# Altium project RcMPPT-SCC.PrjPcb
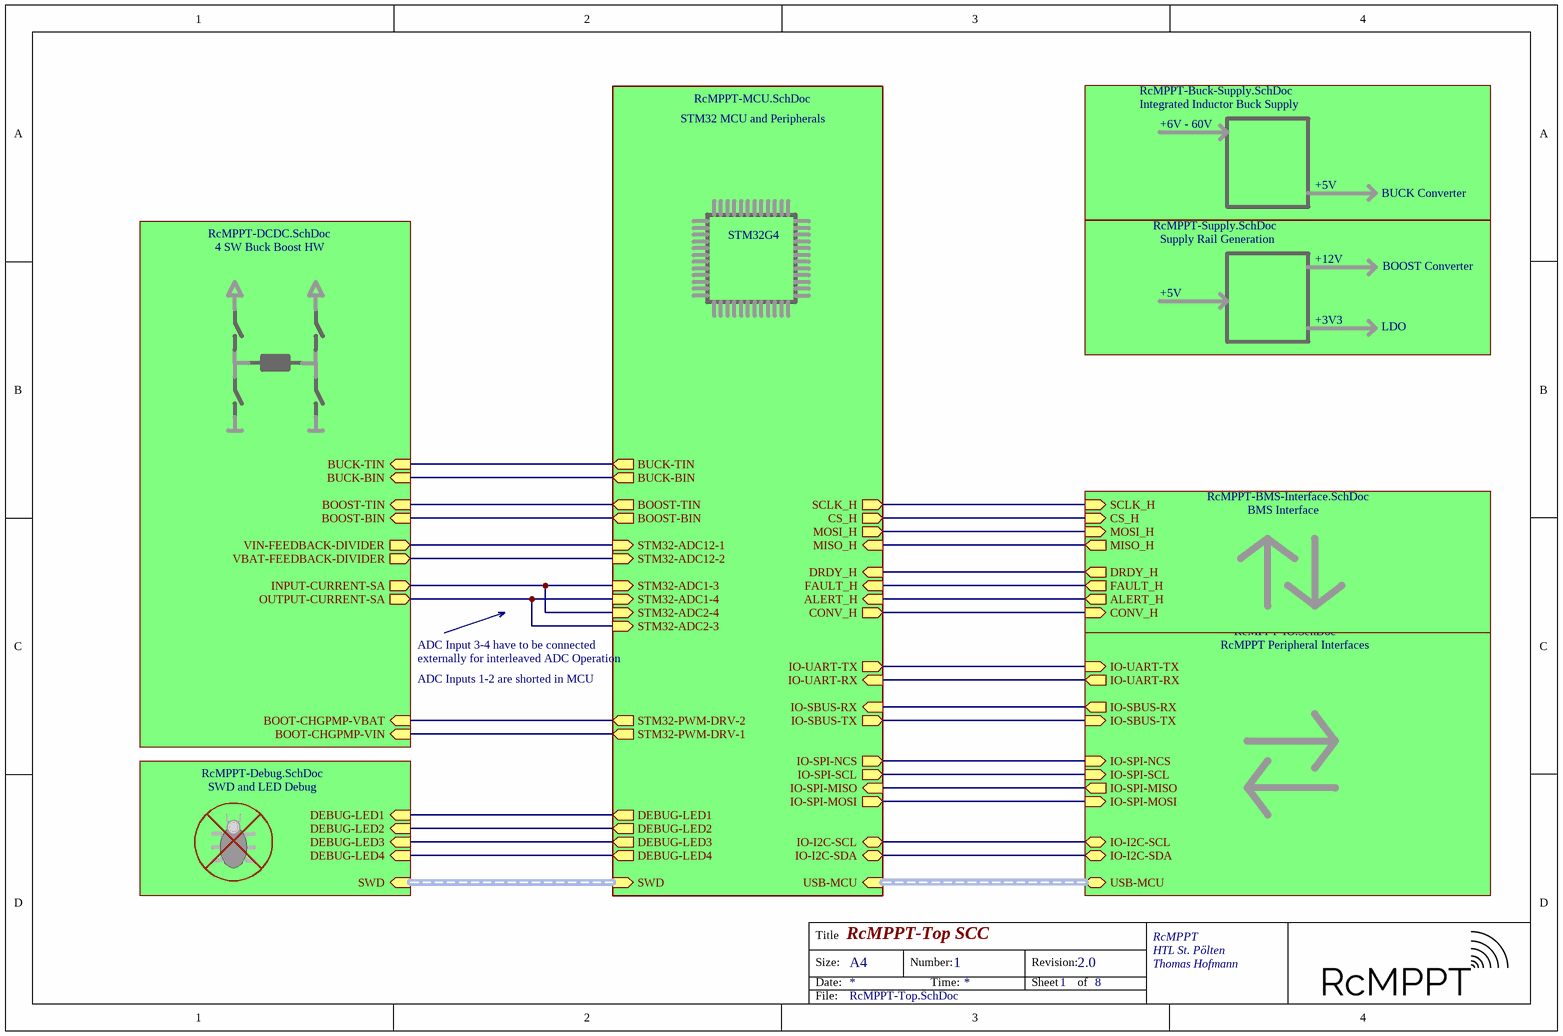
[diagram p0: RcMPPT-Top.SchDoc]
8 sheets, 168 parts. Net scope: hierarchical (ports join the sheet entries above them; power ports are global).
Board file: RcMPPT-SCC.PcbDoc
Sheets:
  RcMPPT-Top.SchDoc
    4 SW Buck Boost HW = RcMPPT-DCDC.SchDoc
    RcMPPT Peripheral Interfaces = RcMPPT-IO.SchDoc
    STM32 MCU and Peripherals = RcMPPT-MCU.SchDoc
    Integrated Inductor Buck Supply = RcMPPT-Buck-Supply.SchDoc
    SWD and LED Debug = RcMPPT-Debug.SchDoc
    Supply Rail Generation = RcMPPT-Supply.SchDoc
    BMS Interface = RcMPPT-BMS-Interface.SchDoc

## Sheet RcMPPT-Top.SchDoc: RcMPPT-Top SCC
size A4; Author: Thomas Hofmann; CompanyName: HTL St. Pölten; Organization: Altium Limited; Address1: RcMPPT; Address2: Frenchs Forest; Address3: NSW; Address4: Australia 2086; DocumentNumber: 1; Revision: 2.0; SheetNumber: 1; SheetTotal: 8

### Sub-sheets
4 SW Buck Boost HW = RcMPPT-DCDC.SchDoc: VBAT-FEEDBACK-DIVIDER (out), VIN-FEEDBACK-DIVIDER (out), BOOST-BIN (in), BOOST-TIN (in), BUCK-TIN (in), BUCK-BIN (in), OUTPUT-CURRENT-SA (out), INPUT-CURRENT-SA (out), BOOT-CHGPMP-VBAT (in), BOOT-CHGPMP-VIN (in)
BMS Interface = RcMPPT-BMS-Interface.SchDoc: DRDY_H (out), FAULT_H (out), SCLK_H (in), CS_H (in), MOSI_H (in), CONV_H (in), MISO_H (out), ALERT_H (out)
Integrated Inductor Buck Supply = RcMPPT-Buck-Supply.SchDoc: no entries
RcMPPT Peripheral Interfaces = RcMPPT-IO.SchDoc: USB-MCU (bidir, harness USB-HARNESS), IO-I2C-SDA (bidir), IO-I2C-SCL (bidir), IO-SPI-MOSI (in), IO-SPI-MISO (out), IO-SPI-SCL (in), IO-SPI-NCS (in), IO-SBUS-TX (in), IO-SBUS-RX (out), IO-UART-RX (out), IO-UART-TX (in)
STM32 MCU and Peripherals = RcMPPT-MCU.SchDoc: STM32-ADC12-2 (in), STM32-ADC12-1 (in), BOOST-BIN (out), BOOST-TIN (out), BUCK-BIN (out), BUCK-TIN (out), USB-MCU (in, harness USB-HARNESS), SWD (in, harness SWD-HARNESS), DEBUG-LED4 (out), DEBUG-LED3 (out), DEBUG-LED2 (out), DEBUG-LED1 (out), STM32-ADC2-4 (in), STM32-ADC2-3 (in), STM32-ADC1-4 (in), STM32-ADC1-3 (in), STM32-PWM-DRV-1 (out), STM32-PWM-DRV-2 (out), IO-I2C-SDA (bidir), IO-I2C-SCL (bidir), IO-SPI-MOSI (out), IO-SPI-MISO (in), IO-SPI-SCL (out), IO-SPI-NCS (out), IO-SBUS-TX (out), IO-SBUS-RX (in), IO-UART-RX (in), IO-UART-TX (out), DRDY_H (in), FAULT_H (in), SCLK_H (out), CS_H (out), MOSI_H (out), CONV_H (out), MISO_H (in), ALERT_H (in)
Supply Rail Generation = RcMPPT-Supply.SchDoc: no entries
SWD and LED Debug = RcMPPT-Debug.SchDoc: SWD (in, harness SWD-HARNESS), DEBUG-LED4 (in), DEBUG-LED3 (in), DEBUG-LED2 (in), DEBUG-LED1 (in)

### Nets
ALERT_H: sheet STM32 MCU and Peripherals/ALERT_H, sheet BMS Interface/ALERT_H
BOOST-BIN: sheet 4 SW Buck Boost HW/BOOST-BIN, sheet STM32 MCU and Peripherals/BOOST-BIN
BOOST-TIN: sheet 4 SW Buck Boost HW/BOOST-TIN, sheet STM32 MCU and Peripherals/BOOST-TIN
BOOT-CHGPMP-VBAT: sheet 4 SW Buck Boost HW/BOOT-CHGPMP-VBAT, sheet STM32 MCU and Peripherals/STM32-PWM-DRV-2
BOOT-CHGPMP-VIN: sheet 4 SW Buck Boost HW/BOOT-CHGPMP-VIN, sheet STM32 MCU and Peripherals/STM32-PWM-DRV-1
BUCK-BIN: sheet 4 SW Buck Boost HW/BUCK-BIN, sheet STM32 MCU and Peripherals/BUCK-BIN
BUCK-TIN: sheet 4 SW Buck Boost HW/BUCK-TIN, sheet STM32 MCU and Peripherals/BUCK-TIN
CONV_H: sheet STM32 MCU and Peripherals/CONV_H, sheet BMS Interface/CONV_H
CS_H: sheet STM32 MCU and Peripherals/CS_H, sheet BMS Interface/CS_H
DEBUG-LED1: sheet STM32 MCU and Peripherals/DEBUG-LED1, sheet SWD and LED Debug/DEBUG-LED1
DEBUG-LED2: sheet STM32 MCU and Peripherals/DEBUG-LED2, sheet SWD and LED Debug/DEBUG-LED2
DEBUG-LED3: sheet STM32 MCU and Peripherals/DEBUG-LED3, sheet SWD and LED Debug/DEBUG-LED3
DEBUG-LED4: sheet STM32 MCU and Peripherals/DEBUG-LED4, sheet SWD and LED Debug/DEBUG-LED4
DRDY_H: sheet STM32 MCU and Peripherals/DRDY_H, sheet BMS Interface/DRDY_H
FAULT_H: sheet STM32 MCU and Peripherals/FAULT_H, sheet BMS Interface/FAULT_H
INPUT-CURRENT-SA: sheet 4 SW Buck Boost HW/INPUT-CURRENT-SA, sheet STM32 MCU and Peripherals/STM32-ADC2-4, sheet STM32 MCU and Peripherals/STM32-ADC1-3
IO-I2C-SCL: sheet RcMPPT Peripheral Interfaces/IO-I2C-SCL, sheet STM32 MCU and Peripherals/IO-I2C-SCL
IO-I2C-SDA: sheet RcMPPT Peripheral Interfaces/IO-I2C-SDA, sheet STM32 MCU and Peripherals/IO-I2C-SDA
IO-SBUS-RX: sheet RcMPPT Peripheral Interfaces/IO-SBUS-RX, sheet STM32 MCU and Peripherals/IO-SBUS-RX
IO-SBUS-TX: sheet RcMPPT Peripheral Interfaces/IO-SBUS-TX, sheet STM32 MCU and Peripherals/IO-SBUS-TX
IO-SPI-MISO: sheet RcMPPT Peripheral Interfaces/IO-SPI-MISO, sheet STM32 MCU and Peripherals/IO-SPI-MISO
IO-SPI-MOSI: sheet RcMPPT Peripheral Interfaces/IO-SPI-MOSI, sheet STM32 MCU and Peripherals/IO-SPI-MOSI
IO-SPI-NCS: sheet RcMPPT Peripheral Interfaces/IO-SPI-NCS, sheet STM32 MCU and Peripherals/IO-SPI-NCS
IO-SPI-SCL: sheet RcMPPT Peripheral Interfaces/IO-SPI-SCL, sheet STM32 MCU and Peripherals/IO-SPI-SCL
IO-UART-RX: sheet RcMPPT Peripheral Interfaces/IO-UART-RX, sheet STM32 MCU and Peripherals/IO-UART-RX
IO-UART-TX: sheet RcMPPT Peripheral Interfaces/IO-UART-TX, sheet STM32 MCU and Peripherals/IO-UART-TX
MISO_H: sheet STM32 MCU and Peripherals/MISO_H, sheet BMS Interface/MISO_H
MOSI_H: sheet STM32 MCU and Peripherals/MOSI_H, sheet BMS Interface/MOSI_H
OUTPUT-CURRENT-SA: sheet 4 SW Buck Boost HW/OUTPUT-CURRENT-SA, sheet STM32 MCU and Peripherals/STM32-ADC2-3, sheet STM32 MCU and Peripherals/STM32-ADC1-4
SCLK_H: sheet STM32 MCU and Peripherals/SCLK_H, sheet BMS Interface/SCLK_H
STM32-ADC12-1: sheet 4 SW Buck Boost HW/VIN-FEEDBACK-DIVIDER, sheet STM32 MCU and Peripherals/STM32-ADC12-1
STM32-ADC12-2: sheet 4 SW Buck Boost HW/VBAT-FEEDBACK-DIVIDER, sheet STM32 MCU and Peripherals/STM32-ADC12-2

### Buses and harness runs
harness sheet RcMPPT Peripheral Interfaces/USB-MCU = sheet STM32 MCU and Peripherals/USB-MCU
harness sheet STM32 MCU and Peripherals/SWD = sheet SWD and LED Debug/SWD

### Notes on the sheet
- +6V - 60V
- STM32G4
- +5V
- BUCK Converter
- +12V
- BOOST Converter
- +3V3
- LDO
- ADC Input 3-4 have to be connected
- ADC Inputs 1-2 are shorted in MCU
- externally for interleaved ADC Operation
- Title
- Size:
- Date:
- A4
- Number:
- Time:
- Revision:
- Sheet
- of
- RcMPPT
- File:

## Sheet RcMPPT-DCDC.SchDoc: RcMPPT-DCDC
size A4; Author: Thomas Hofmann; CompanyName: HTL St. Pölten; Organization: Altium Limited; Address1: RcMPPT; Address2: Frenchs Forest; Address3: NSW; Address4: Australia 2086; DocumentNumber: 4; Revision: 2.0; SheetNumber: 4; SheetTotal: 8
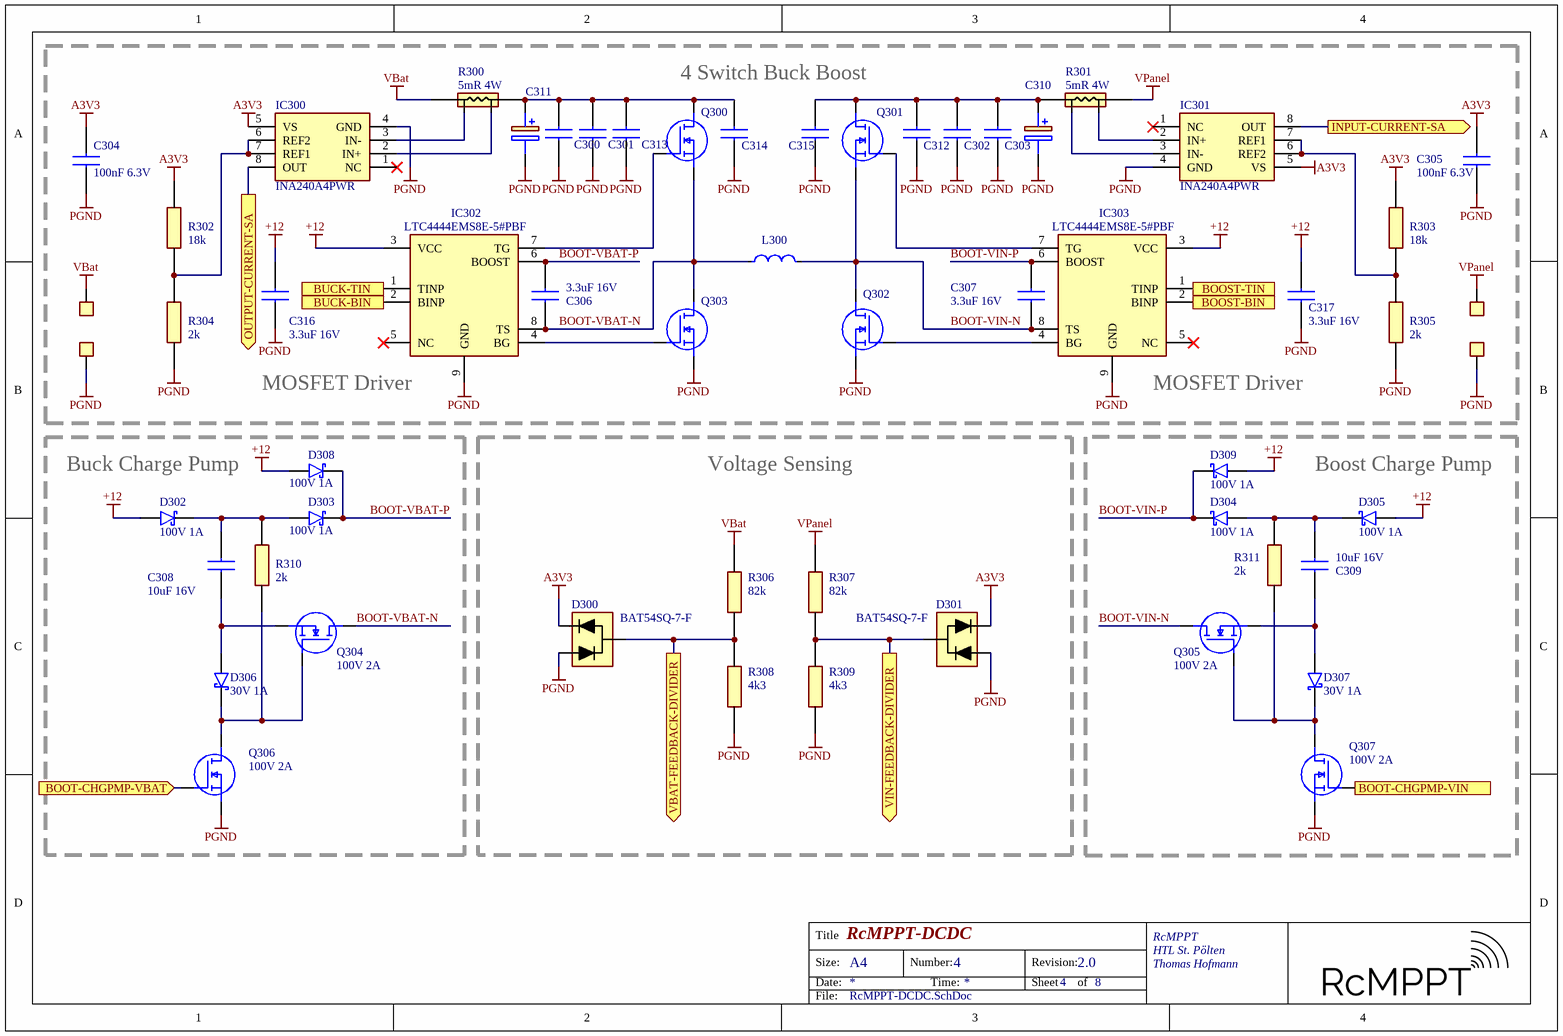
[diagram p1: RcMPPT-DCDC.SchDoc]

### Parts
C300  10uF 100V  [CAPC3225X270N]  (value not drawn)
C301  10uF 100V  [CAPC3225X270N]  (value not drawn)
C302  10uF 100V  [CAPC3225X270N]  (value not drawn)
C303  10uF 100V  [CAPC3225X270N]  (value not drawn)
C304  100nF 6.3V  [CAPC1608X97N]
C305  100nF 6.3V  [CAPC1608X97N]
C306  3.3uF 16V  [CAPC1608X97N]
C307  3.3uF 16V  [CAPC1608X97N]
C308  10uF 16V  [CAPC2012X88N]
C309  10uF 16V  [CAPC2012X88N]
C310  47uF 100VDC 10mm  [CAPAE1030X1050N]  (value not drawn)
C311  47uF 100VDC 10mm  [CAPAE1030X1050N]  (value not drawn)
C312  10uF 100V  [CAPC3225X270N]  (value not drawn)
C313  10uF 100V  [CAPC3225X270N]  (value not drawn)
C314  10uF 100V  [CAPC3225X270N]  (value not drawn)
C315  10uF 100V  [CAPC3225X270N]  (value not drawn)
C316  3.3uF 16V  [CAPC1608X97N]
C317  3.3uF 16V  [CAPC1608X97N]
D300  BAT54SQ-7-F  [SOT96P240X110-3N]
D301  BAT54SQ-7-F  [SOT96P240X110-3N]
D302  100V 1A  [SOD-323]
D303  100V 1A  [SOD-323]
D304  100V 1A  [SOD-323]
D305  100V 1A  [SOD-323]
D306  30V 1A  [SOD-323]
D307  30V 1A  [SOD-323]
D308  100V 1A  [SOD-323]
D309  100V 1A  [SOD-323]
IC300  INA240A4PWR  [SOP65P640X120-8N]
IC301  INA240A4PWR  [SOP65P640X120-8N]
IC302  LTC4444EMS8E-5#PBF  [SOP65P490X110-9N]
IC303  LTC4444EMS8E-5#PBF  [SOP65P490X110-9N]
L300  IHLP6767GZER2R2M01  [FP-IHLP-6767GZ-FP_3_825x1-MFG]  (value not drawn)
P300  PowerPad  [POWER_PAD]  (value not drawn)
P301  PowerPad  [POWER_PAD]  (value not drawn)
P302  PowerPad  [POWER_PAD]  (value not drawn)
P303  PowerPad  [POWER_PAD]  (value not drawn)
Q300  SIR680ADP-T1-RE3  [SI7141DPT1GE3]  (value not drawn)
Q301  SIR680ADP-T1-RE3  [SI7141DPT1GE3]  (value not drawn)
Q302  SIR680ADP-T1-RE3  [SI7141DPT1GE3]  (value not drawn)
Q303  SIR680ADP-T1-RE3  [SI7141DPT1GE3]  (value not drawn)
Q304  100V 2A  [SI2305TP]
Q305  100V 2A  [SI2305TP]
Q306  100V 2A  [SI2305TP]
Q307  100V 2A  [SI2305TP]
R300  5mR 4W  [FC4L90R005FER]
R301  5mR 4W  [FC4L90R005FER]
R302  18k  [RESC1005X40N]
R303  18k  [RESC1005X40N]
R304  2k  [RESC1005X40N]
R305  2k  [RESC1005X40N]
R306  82k  [RESC1608X50N]
R307  82k  [RESC1608X50N]
R308  4k3  [RESC1608X50N]
R309  4k3  [RESC1608X50N]
R310  2k  [RESC1608X50N]
R311  2k  [RESC1608X50N]

### Blocks framed on the sheet
Buck Charge Pump: C308 D302 D303 D306 D308 Q304 Q306 R310
Voltage Sensing: D300 D301 R306-R309
Boost Charge Pump: C309 D304 D305 D307 D309 Q305 Q307 R311

### Ports
BOOST-BIN (in), BOOST-TIN (in), BOOT-CHGPMP-VBAT (in), BOOT-CHGPMP-VIN (in), BUCK-BIN (in), BUCK-TIN (in), INPUT-CURRENT-SA (out), OUTPUT-CURRENT-SA (out), VBAT-FEEDBACK-DIVIDER (out), VIN-FEEDBACK-DIVIDER (out)

### Nets
+12: C316.1 C317.1 D302.2(A) D305.2(A) D308.2(A) D309.2(A) IC302.3(VCC) IC303.3(VCC)
A3V3: C304.2 C305.2 D300.2(K) D301.2(K) IC300.5(VS) IC301.5(VS) R302.2 R303.2
PGND: C300.2 C301.2 C302.2 C303.2 C304.1 C305.1 C310.2(-) C311.2(-) C312.2 C313.2 C314.2 C315.2 C316.2 C317.2 D300.1(A) D301.1(A) IC300.4(GND) IC301.4(GND) IC302.9(GND) IC303.9(GND) P302.1 P303.1 Q302.1,_2,_3(S) Q303.1,_2,_3(S) Q306.2(S) Q307.2(S) R304.1 R305.1 R308.1 R309.1
VBat: P300.1 R300.3 R306.2
VPanel: P301.1 R301.2 R307.2
BOOST-BIN: IC303.2(BINP) ; port BOOST-BIN
BOOST-TIN: IC303.1(TINP) ; port BOOST-TIN
BOOT-CHGPMP-VBAT: Q306.1(G) ; port BOOT-CHGPMP-VBAT
BOOT-CHGPMP-VIN: Q307.1(G) ; port BOOT-CHGPMP-VIN
BOOT-VBAT-N: C306.2 IC302.8(TS) L300.1 Q300.1,_2,_3(S) Q303.5,6,7,8,9,10,11(D) Q304.3(D)  [project net BOOT-VBAT-N_4]
BOOT-VBAT-P: C306.1 D303.1(K) D308.1(K) IC302.6(BOOST)  [project net BOOT-VBAT-P_4]
BOOT-VIN-N: C307.2 IC303.8(TS) L300.2 Q301.1,_2,_3(S) Q302.5,6,7,8,9,10,11(D) Q305.3(D)  [project net BOOT-VIN-N_4]
BOOT-VIN-P: C307.1 D304.1(K) D309.1(K) IC303.6(BOOST)  [project net BOOT-VIN-P_4]
BUCK-BIN: IC302.2(BINP) ; port BUCK-BIN
BUCK-TIN: IC302.1(TINP) ; port BUCK-TIN
INPUT-CURRENT-SA: IC301.8(OUT) ; port INPUT-CURRENT-SA
OUTPUT-CURRENT-SA: IC300.8(OUT) ; port OUTPUT-CURRENT-SA
STM32-ADC12-1: D301.3(A/K) R307.1 R309.2 ; port VIN-FEEDBACK-DIVIDER
STM32-ADC12-2: D300.3(A/K) R306.1 R308.2 ; port VBAT-FEEDBACK-DIVIDER
NetC300_1: C300.1 C301.1 C311.1(+) C313.1 C314.1 Q300.5,6,7,8,9,10,11(D) R300.2
NetC302_1: C302.1 C303.1 C310.1(+) C312.1 C315.1 Q301.5,6,7,8,9,10,11(D) R301.3
NetC308_1: C308.1 D306.2(A) Q304.2(S)
NetC308_2: C308.2 D302.1(K) D303.2(A) R310.2
NetC309_1: C309.1 D307.2(A) Q305.2(S)
NetC309_2: C309.2 D304.2(A) D305.1(K) R311.2
NetD306_1: D306.1(K) Q304.1(G) Q306.3(D) R310.1
NetD307_1: D307.1(K) Q305.1(G) Q307.3(D) R311.1
NetIC300_2: IC300.2(IN+) R300.1
NetIC300_3: IC300.3(IN-) R300.4
NetIC300_6: IC300.6(REF2) IC300.7(REF1) R302.1 R304.2
NetIC301_2: IC301.2(IN+) R301.1
NetIC301_3: IC301.3(IN-) R301.4
NetIC301_6: IC301.6(REF2) IC301.7(REF1) R303.1 R305.2
NetIC302_4: IC302.4(BG) Q303.4(G)
NetIC302_7: IC302.7(TG) Q300.4(G)
NetIC303_4: IC303.4(BG) Q302.4(G)
NetIC303_7: IC303.7(TG) Q301.4(G)

Not connected (* = marked no-connect by the designer): IC300 1(NC)*; IC301 1(NC)*; IC302 5(NC)*; IC303 5(NC)*

### Notes on the sheet
- 4 Switch Buck Boost
- (near IC302) MOSFET Driver
- (near IC303) MOSFET Driver
- Title
- Size:
- Date:
- A4
- Number:
- Time:
- Revision:
- Sheet
- of
- RcMPPT
- File:

### Library data of the parts
C300-C303 C312-C315 = C1210: Capacitor; Height: 0.97mm
C304-C307 C316 C317 = C0603: Capacitor; Height: 0.97
C308 C309 = C0805: Capacitor; Height: 0.97
C310 C311 = ELKO: Capacitor Polarised
D300 D301 = BAT54SQ-7-F: Schottky Diode; Manufacturer_Name: Diodes Inc.; Datasheet Link: https://www.arrow.com/en/products/bat54sq-7-f/diodes-incorporated; Height: 1.1mm; Manufacturer_Part_Number: BAT54SQ-7-F; Mouser Part Number: 621-BAT54SQ-7-F; Mouser Price/Stock: https://www.mouser.co.uk/ProductDetail/Diodes-Incorporated/BAT54SQ-7-F/?qs=vdQOMtKMWaAKaYcjx11stw%3D%3D; Arrow Part Number: BAT54SQ-7-F; Arrow Price/Stock: https://www.arrow.com/en/products/bat54sq-7-f/diodes-incorporated
D302-D309 = SCHOTTKY-DIODE: Schottky Diode
IC300 IC301 = INA240A4PWR: Integrated Circuit; Manufacturer_Name: Texas Instruments; Datasheet Link: http://www.ti.com/lit/ds/symlink/ina240.pdf; Height: 1.2mm; Manufacturer_Part_Number: INA240A4PWR; Mouser Part Number: 595-INA240A4PWR; Mouser Price/Stock: https://www.mouser.co.uk/ProductDetail/Texas-Instruments/INA240A4PWR?qs=aVyJF2WnouQ31PAZ9p0r8w%3D%3D; Arrow Part Number: INA240A4PWR; Arrow Price/Stock: https://www.arrow.com/en/products/ina240a4pwr/texas-instruments?region=nac
IC302 IC303 = LTC4444EMS8E-5#PBF: Integrated Circuit; Manufacturer_Name: Linear Technology; Datasheet Link: http://www.linear.com/docs/26366; Height: 1.1mm; Manufacturer_Part_Number: LTC4444EMS8E-5#PBF; Arrow Part Number: LTC4444EMS8E-5#PBF; Arrow Price/Stock: https://www.arrow.com/en/products/ltc4444ems8e-5pbf/linear-technology; Mouser Part Number: 584-C4444EMS8E-5PBF; Mouser Price/Stock: https://www.mouser.com/Search/Refine.aspx?Keyword=584-C4444EMS8E-5PBF
L300 = IHLP6767GZER2R2M01: Commercial Inductors, High Saturation Series 2.2uH 35A 2.53mΩ 20%; Manufacturer: Vishay Dale; Max DC Current: 62A; Shielding: Shielded; Self Resonant Frequency: 2MHz; DC Resistance (DCR): 2.53mR; Core Material: Metal; Test Frequency: 100kHz; Tolerance: 20%; Termination: SMD/SMT; RMS Current (Irms): 35A; Depth: 17.15mm; Package Quantity: 200; Mount: Surface Mount; Case/Package: 6767; Saturation Current: 62A; Radiation Hardening: No; Height - Seated (Max): 0.276inch; Lead Free: Lead Free; Max Operating Temperature: 125°C; Inductance Tolerance: 20%; Packaging: Tape and Reel; Number of Pins: 6767; Current Rating: 35A; Military Standard: Not; Min Operating Temperature: -55°C; Inductance: 2.2uH; Width: 0.675inch; Height: 7mm; Length: 17.15mm; Manufacturer Part Number: IHLP6767GZER2R2M01
Q300-Q303 = SIR680ADP-T1-RE3: MOSFET (N-Channel); pin to pad: 1,2,3>1+2+3 1, 2, 3>1+2+3 5,6,7,8,9,10,11>5+6+7+8+9+10+11; Manufacturer_Name: Vishay; Datasheet Link: https://componentsearchengine.com/Datasheets/2/SIR680ADP-T1-RE3.pdf; Height: 1.12mm; Manufacturer_Part_Number: SIR680ADP-T1-RE3; Mouser Part Number: 78-SIR680ADP-T1-RE3; Mouser Price/Stock: https://www.mouser.co.uk/ProductDetail/Vishay-Semiconductors/SIR680ADP-T1-RE3?qs=Cb2nCFKsA8raqFl13vB9OA%3D%3D
Q304-Q307 = NMOS: MOSFET (N-Channel)
R300 R301 = FC4L90R005FER: Shunt; Manufacturer_Name: Ohmite; Datasheet Link: https://componentsearchengine.com/Datasheets/2/FC4L90R005FER.pdf; Height: 0.8mm; Manufacturer_Part_Number: FC4L90R005FER; Mouser Part Number: 588-FC4L90R005FER; Mouser Price/Stock: https://www.mouser.co.uk/ProductDetail/Ohmite/FC4L90R005FER?qs=lc2O%252BfHJPVbbUOwenJZbzA%3D%3D
R302-R305 = R0402: Resistor; Height: 0.4mm
R306-R311 = R0603: Resistor; Height: 0.55mm

## Sheet RcMPPT-IO.SchDoc: RcMPPT-IO
size A4; Author: Thomas Hofmann; CompanyName: HTL St. Pölten; Organization: Altium Limited; Address1: RcMPPT; Address2: Frenchs Forest; Address3: NSW; Address4: Australia 2086; DocumentNumber: 5; Revision: 2.0; SheetNumber: 5; SheetTotal: 8
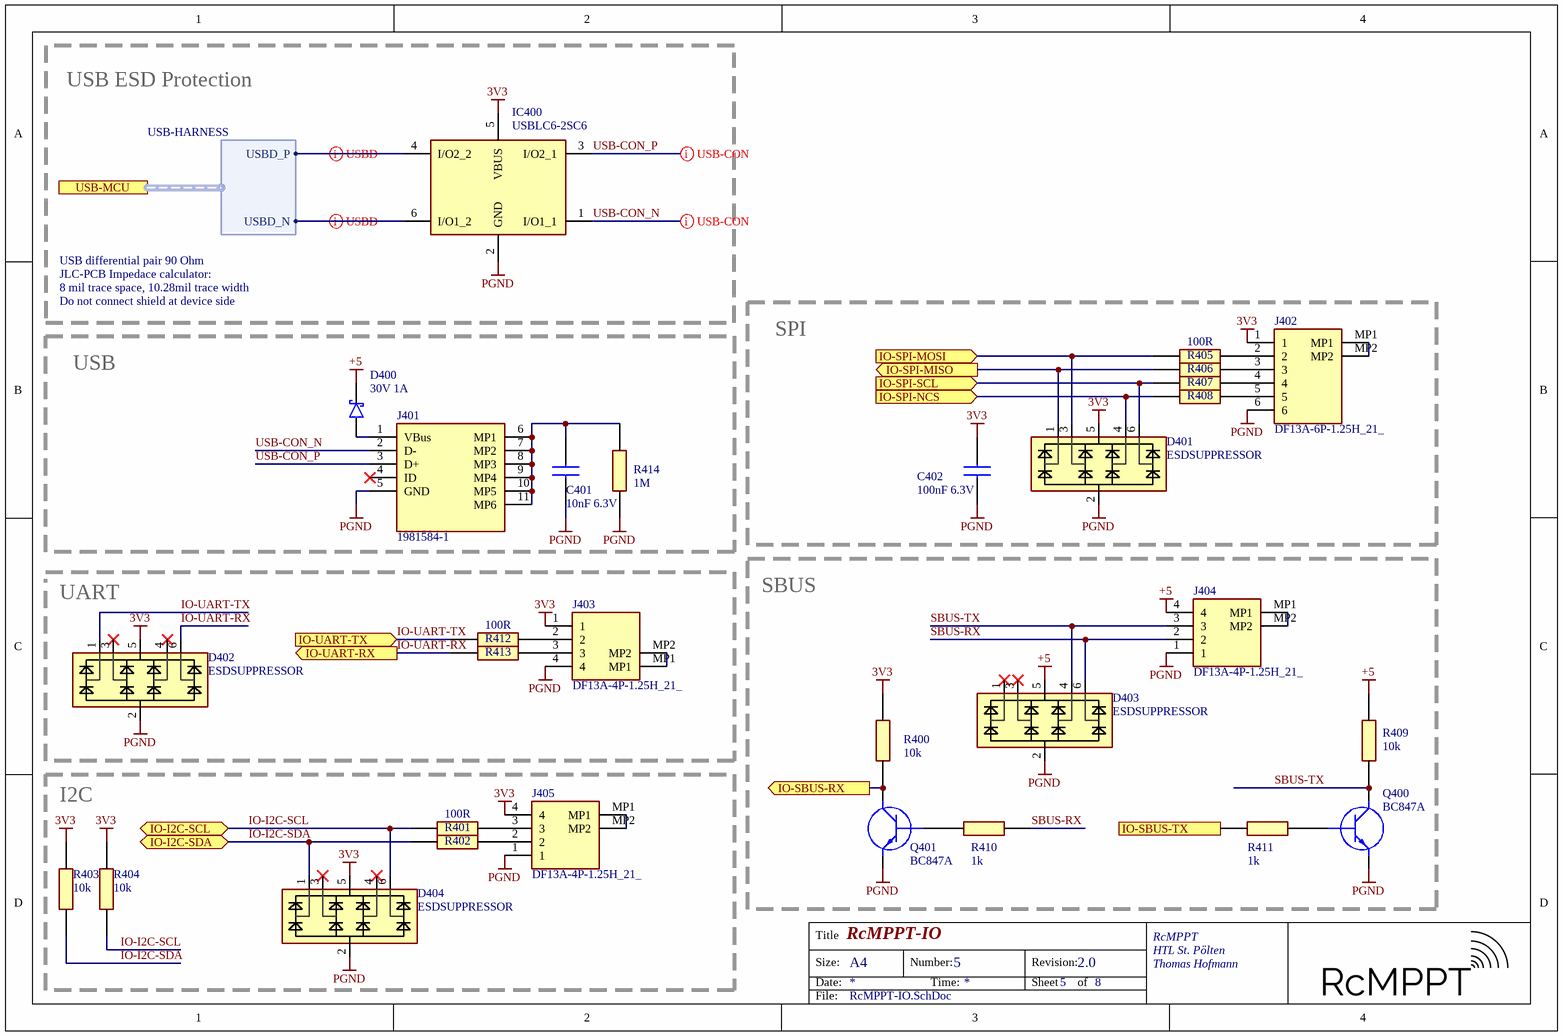
[diagram p2: RcMPPT-IO.SchDoc]

### Parts
C401  10nF 6.3V  [CAPC1608X97N]
C402  100nF 6.3V  [CAPC1608X97N]
D400  30V 1A  [SOD-323]
D401  ESDSUPPRESSOR  [SOT23-6]
D402  ESDSUPPRESSOR  [SOT23-6]
D403  ESDSUPPRESSOR  [SOT23-6]
D404  ESDSUPPRESSOR  [SOT23-6]
IC400  USBLC6-2SC6  [SOT95P280X145-6N]
J401  1981584-1  [19815841]
J402  DF13A-6P-1.25H_21_  [DF13A6P125H21]
J403  DF13A-4P-1.25H_21_  [DF13A4P125H21]
J404  DF13A-4P-1.25H_21_  [DF13A4P125H21]
J405  DF13A-4P-1.25H_21_  [DF13A4P125H21]
Q400  BC847A  [SOT95P230X110-3N]
Q401  BC847A  [SOT95P230X110-3N]
R400  10k  [RESC1608X50N]
R401  100R  [RESC1005X40N]
R402  100R  [RESC1005X40N]  (value not drawn)
R403  10k  [RESC1608X50N]
R404  10k  [RESC1608X50N]
R405  100R  [RESC1005X40N]
R406  100R  [RESC1005X40N]  (value not drawn)
R407  100R  [RESC1005X40N]  (value not drawn)
R408  100R  [RESC1005X40N]  (value not drawn)
R409  10k  [RESC1608X50N]
R410  1k  [RESC1608X50N]
R411  1k  [RESC1608X50N]
R412  100R  [RESC1005X40N]
R413  100R  [RESC1005X40N]  (value not drawn)
R414  1M  [RESC1608X50N]

### Blocks framed on the sheet
SPI: C402 D401 J402 R405-R408
USB: C401 D400 J401 R414
SBUS: D403 J404 Q400 Q401 R400 R409-R411
I2C: D404 J405 R401-R404

### Ports
IO-I2C-SCL (bidir), IO-I2C-SDA (bidir), IO-SBUS-RX (out), IO-SBUS-TX (in), IO-SPI-MISO (out), IO-SPI-MOSI (in), IO-SPI-NCS (in), IO-SPI-SCL (in), IO-UART-RX (out), IO-UART-TX (in), USB-MCU (harness USB-HARNESS)

### Harnesses
USB-HARNESS: USBD_P, USBD_N

### Nets
3V3: C402.2 D401.5(VDD) D402.5(VDD) D404.5(VDD) IC400.5(VBUS) J402.1 J403.1 J405.4 R400.2 R403.1 R404.1
+5: D400.1(K) D403.5(VDD) J404.4 R409.2
PGND: C401.1 C402.1 D401.2(GND) D402.2(GND) D403.2(GND) D404.2(GND) IC400.2(GND) J401.5(GND) J402.6 J403.4 J404.1 J405.1 Q400.2(E) Q401.2(E) R414.1
IO-I2C-SCL: D404.6(CH4) R401.1 R404.2 ; port IO-I2C-SCL
IO-I2C-SDA: D404.1(CH1) R402.1 R403.2 ; port IO-I2C-SDA
IO-SBUS-RX: Q401.3(C) R400.1 ; port IO-SBUS-RX
IO-SBUS-TX: R411.2 ; port IO-SBUS-TX
IO-SPI-MISO: D401.1(CH1) R406.1 ; port IO-SPI-MISO
IO-SPI-MOSI: D401.3(CH2) R405.1 ; port IO-SPI-MOSI
IO-SPI-NCS: D401.4(CH3) R408.1 ; port IO-SPI-NCS
IO-SPI-SCL: D401.6(CH4) R407.1 ; port IO-SPI-SCL
IO-UART-RX: D402.6(CH4) R413.1 ; port IO-UART-RX
IO-UART-TX: D402.1(CH1) R412.1 ; port IO-UART-TX
SBUS-RX: D403.6(CH4) J404.2 R410.2  [project net SBUS-RX_5]
SBUS-TX: D403.4(CH3) J404.3 Q400.3(C) R409.1  [project net SBUS-TX_5]
USB-CON_N: IC400.1(I/O1_1) J401.2(D-)  [project net USB-CON_N_5]
USB-CON_P: IC400.3(I/O2_1) J401.3(D+)  [project net USB-CON_P_5]
NetC401_2: C401.2 J401.6(MP1) J401.7(MP2) J401.8(MP3) J401.9(MP4) J401.10(MP5) J401.11(MP6) R414.2
NetD400_2: D400.2(A) J401.1(VBus)
NetIC100_45: IC400.6(I/O1_2) ; port USB-MCU.USBD_N
NetIC100_46: IC400.4(I/O2_2) ; port USB-MCU.USBD_P
NetJ402_2: J402.2 R405.2
NetJ402_3: J402.3 R406.2
NetJ402_4: J402.4 R407.2
NetJ402_5: J402.5 R408.2
NetJ402_MP1: J402.MP1 J402.MP2
NetJ403_2: J403.2 R412.2
NetJ403_3: J403.3 R413.2
NetJ403_MP1: J403.MP1 J403.MP2
NetJ404_MP1: J404.MP1 J404.MP2
NetJ405_2: J405.2 R402.2
NetJ405_3: J405.3 R401.2
NetJ405_MP1: J405.MP1 J405.MP2
NetQ400_1: Q400.1(B) R411.1
NetQ401_1: Q401.1(B) R410.1

Not connected (* = marked no-connect by the designer): D402 3(CH2)* 4(CH3)*; D403 1(CH1)* 3(CH2)*; D404 3(CH2)* 4(CH3)*; J401 4(ID)*

### Layout directives
differential pair: NetIC100_45, NetIC100_46, USB-CON_N_5, USB-CON_P_5

### Notes on the sheet
- USB ESD Protection
- USB differential pair 90 Ohm
- JLC-PCB Impedace calculator:
- Do not connect shield at device side
- 8 mil trace space, 10.28mil trace width
- (near D402) UART
- Title
- Size:
- Date:
- A4
- Number:
- Time:
- Revision:
- Sheet
- of
- RcMPPT
- File:

### Library data of the parts
C401 C402 = C0603: Capacitor; Height: 0.97
D400 = SCHOTTKY-DIODE: Schottky Diode
D401-D404 = ESDSUPPRESSOR: TVS Diode Array; Height: 0.6mm
IC400 = USBLC6-2SC6: Integrated Circuit; Manufacturer_Name: STMicroelectronics; Datasheet Link: http://www.st.com/st-web-ui/static/active/en/resource/technical/document/datasheet/CD00050750.pdf; Height: 1.45mm; Manufacturer_Part_Number: USBLC6-2SC6; Arrow Part Number: USBLC6-2SC6; Arrow Price/Stock: https://www.arrow.com/en/products/usblc6-2sc6/stmicroelectronics; Mouser Part Number: 511-USBLC6-2SC6; Mouser Price/Stock: https://www.mouser.co.uk/ProductDetail/STMicroelectronics/USBLC6-2SC6?qs=po45yt2pPpu%2FhNIlwQdTlg%3D%3D
J401 = 1981584-1: Connector; Manufacturer_Name: TE Connectivity; Datasheet Link: http://www.te.com/commerce/DocumentDelivery/DDEController?Action=showdoc&DocId=Customer+Drawing%7F1981584%7FD2%7Fpdf%7FEnglish%7FENG_CD_1981584_D2.pdf%7F1981584-1; Height: 3mm; Manufacturer_Part_Number: 1981584-1; Arrow Part Number: 1981584-1; Arrow Price/Stock: https://www.arrow.com/en/products/1981584-1/te-connectivity; Mouser Part Number: 571-1981584-1; Mouser Price/Stock: https://www.mouser.co.uk/ProductDetail/TE-Connectivity/1981584-1?qs=ozkTL%2FUej0TLYxjQLPnd2Q%3D%3D
J402 = DF13A-6P-1.25H_21_: Connector; Manufacturer_Name: Hirose; Manufacturer_Part_Number: DF13A-6P-1.25H(21); Datasheet Link: https://www.hirose.com/product/download/?distributor=digikey&type=2d&lang=en&num=DF13A-6P-1.25H(21); Height: 3.75mm; Mouser Part Number: 798-DF13A6P125H21; Mouser Price/Stock: https://www.mouser.co.uk/ProductDetail/Hirose-Connector/DF13A-6P-125H21?qs=XQjbzJWzFPXnreVi%252BPl0Lg%3D%3D; Arrow Part Number: DF13A-6P-1.25H(21); Arrow Price/Stock: https://www.arrow.com/en/products/df13a-6p-1.25h-21/hirose-electric
J403-J405 = DF13A-4P-1.25H_21_: Connector; Manufacturer_Name: Hirose; Manufacturer_Part_Number: DF13A-4P-1.25H(21); Datasheet Link: https://componentsearchengine.com/Datasheets/1/DF13A-4P-1.25H(21).pdf; Height: 3.6mm; Mouser Part Number: 798-DF13A4P125H21; Mouser Price/Stock: https://www.mouser.co.uk/ProductDetail/Hirose-Connector/DF13A-4P-125H21?qs=XQjbzJWzFPXWzMShI70F0w%3D%3D
Q400 Q401 = BC847A,235: Transistor BJT NPN; Manufacturer_Name: Nexperia; Datasheet Link: http://assets.nexperia.com/documents/data-sheet/BC847_SER.pdf; Height: 1.1mm; Manufacturer_Part_Number: BC847A,235; Mouser Part Number: 771-BC847A235; Mouser Price/Stock: https://www.mouser.co.uk/ProductDetail/Nexperia/BC847A235?qs=me8TqzrmIYWeD%252BqPzufrRA%3D%3D; Arrow Part Number: BC847A,235; Arrow Price/Stock: https://www.arrow.com/en/products/bc847a235/nexperia
R400 R403 R404 R409-R411 R414 = R0603: Resistor; Height: 0.55mm
R401 R402 R405-R408 R412 R413 = R0402: Resistor; Height: 0.4mm

## Sheet RcMPPT-MCU.SchDoc: RcMPPT-MCU
size A4; Author: Thomas Hofmann; CompanyName: HTL St.Pölten; Organization: Altium Limited; Address1: RcMPPT; Address4: Australia 2086; DocumentNumber: 1; Revision: 2.0; SheetNumber: 3; SheetTotal: 8
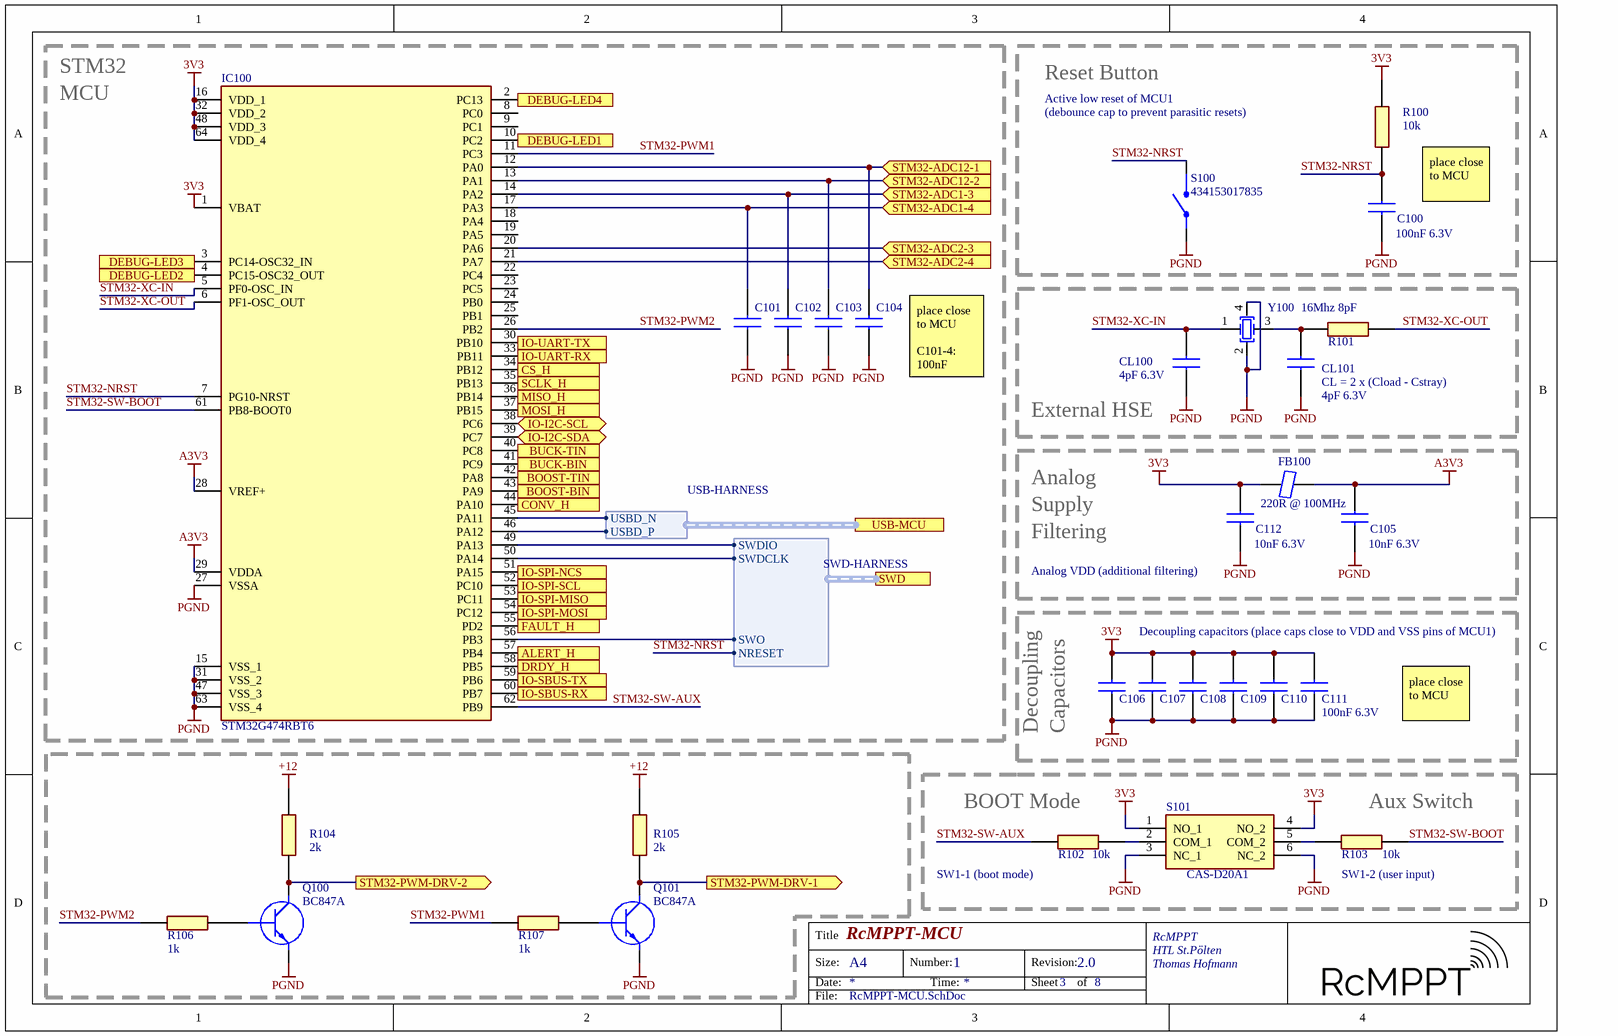
[diagram p3: RcMPPT-MCU.SchDoc]

### Parts
C100  100nF 6.3V  [CAPC1608X97N]
C101  100nF 6.3V  [CAPC1005X55N]  (value not drawn)
C102  100nF 6.3V  [CAPC1005X55N]  (value not drawn)
C103  100nF 6.3V  [CAPC1005X55N]  (value not drawn)
C104  100nF 6.3V  [CAPC1005X55N]  (value not drawn)
C105  10nF 6.3V  [CAPC1608X97N]
C106  100nF 6.3V  [CAPC1608X97N]  (value not drawn)
C107  100nF 6.3V  [CAPC1608X97N]  (value not drawn)
C108  100nF 6.3V  [CAPC1608X97N]  (value not drawn)
C109  100nF 6.3V  [CAPC1608X97N]  (value not drawn)
C110  100nF 6.3V  [CAPC1608X97N]  (value not drawn)
C111  100nF 6.3V  [CAPC1608X97N]
C112  10nF 6.3V  [CAPC1608X97N]
CL100  4pF 6.3V  [CAPC1608X97N]
CL101  4pF 6.3V  [CAPC1608X97N]
FB100  220R @ 100MHz  [FB0603]
IC100  STM32G474RBT6  [QFP50P1200X1200X160-64N]
Q100  BC847A  [SOT95P230X110-3N]
Q101  BC847A  [SOT95P230X110-3N]
R100  10k  [RESC1608X50N]
R101  22R  [RESC1005X40N]  (value not drawn)
R102  10k  [RESC1608X50N]
R103  10k  [RESC1608X50N]
R104  2k  [RESC1608X50N]
R105  2k  [RESC1608X50N]
R106  1k  [RESC1608X50N]
R107  1k  [RESC1608X50N]
S100  434153017835  [434153017835]
S101  CAS-D20A1  [CASD20A1]
Y100  16Mhz 8pF  [ABM8W160000MHZ8B1UT3]

### Blocks framed on the sheet
Reset Button: C100 R100 S100
External HSE: CL100 CL101 R101 Y100

### Ports
ALERT_H (in), BOOST-BIN (out), BOOST-TIN (out), BUCK-BIN (out), BUCK-TIN (out), CONV_H (out), CS_H (out), DEBUG-LED1 (out), DEBUG-LED2 (out), DEBUG-LED3 (out), DEBUG-LED4 (out), DRDY_H (in), FAULT_H (in), IO-I2C-SCL (bidir), IO-I2C-SDA (bidir), IO-SBUS-RX (in), IO-SBUS-TX (out), IO-SPI-MISO (in), IO-SPI-MOSI (out), IO-SPI-NCS (out), IO-SPI-SCL (out), IO-UART-RX (in), IO-UART-TX (out), MISO_H (in), MOSI_H (out), SCLK_H (out), STM32-ADC1-3 (in), STM32-ADC1-4 (in), STM32-ADC2-3 (in), STM32-ADC2-4 (in), STM32-ADC12-1 (in), STM32-ADC12-2 (in), STM32-PWM-DRV-1 (out), STM32-PWM-DRV-2 (out), SWD (harness SWD-HARNESS), USB-MCU (harness USB-HARNESS)

### Harnesses
USB-HARNESS: USBD_P, USBD_N
SWD-HARNESS: SWDIO, SWDCLK, SWO, NRESET

### Nets
3V3: C106.1 C107.1 C108.1 C109.1 C110.1 C111.1 C112.1 FB100.1 IC100.1(VBAT) IC100.16(VDD_1) IC100.32(VDD_2) IC100.48(VDD_3) IC100.64(VDD_4) R100.1 S101.1(NO_1) S101.4(NO_2)
+12: R104.2 R105.2
A3V3: C105.1 FB100.2 IC100.28(VREF+) IC100.29(VDDA)
PGND: C100.2 C101.1 C102.1 C103.1 C104.1 C105.2 C106.2 C107.2 C108.2 C109.2 C110.2 C111.2 C112.2 CL100.1 CL101.1 IC100.15(VSS_1) IC100.27(VSSA) IC100.31(VSS_2) IC100.47(VSS_3) IC100.63(VSS_4) Q100.2(E) Q101.2(E) S100.1,4(NO) S101.3(NC_1) S101.6(NC_2) Y100.2(OSC2) Y100.4
ALERT_H: IC100.57(PB4) ; port ALERT_H
BOOST-BIN: IC100.43(PA9) ; port BOOST-BIN
BOOST-TIN: IC100.42(PA8) ; port BOOST-TIN
BOOT-CHGPMP-VBAT: Q100.3(C) R104.1 ; port STM32-PWM-DRV-2
BOOT-CHGPMP-VIN: Q101.3(C) R105.1 ; port STM32-PWM-DRV-1
BUCK-BIN: IC100.41(PC9) ; port BUCK-BIN
BUCK-TIN: IC100.40(PC8) ; port BUCK-TIN
CONV_H: IC100.44(PA10) ; port CONV_H
CS_H: IC100.34(PB12) ; port CS_H
DEBUG-LED1: IC100.10(PC2) ; port DEBUG-LED1
DEBUG-LED2: IC100.4(PC15-OSC32_OUT) ; port DEBUG-LED2
DEBUG-LED3: IC100.3(PC14-OSC32_IN) ; port DEBUG-LED3
DEBUG-LED4: IC100.2(PC13) ; port DEBUG-LED4
DRDY_H: IC100.58(PB5) ; port DRDY_H
FAULT_H: IC100.55(PD2) ; port FAULT_H
INPUT-CURRENT-SA: C102.2 IC100.14(PA2) IC100.21(PA7) ; port STM32-ADC1-3, port STM32-ADC2-4
IO-I2C-SCL: IC100.38(PC6) ; port IO-I2C-SCL
IO-I2C-SDA: IC100.39(PC7) ; port IO-I2C-SDA
IO-SBUS-RX: IC100.60(PB7) ; port IO-SBUS-RX
IO-SBUS-TX: IC100.59(PB6) ; port IO-SBUS-TX
IO-SPI-MISO: IC100.53(PC11) ; port IO-SPI-MISO
IO-SPI-MOSI: IC100.54(PC12) ; port IO-SPI-MOSI
IO-SPI-NCS: IC100.51(PA15) ; port IO-SPI-NCS
IO-SPI-SCL: IC100.52(PC10) ; port IO-SPI-SCL
IO-UART-RX: IC100.33(PB11) ; port IO-UART-RX
IO-UART-TX: IC100.30(PB10) ; port IO-UART-TX
MISO_H: IC100.36(PB14) ; port MISO_H
MOSI_H: IC100.37(PB15) ; port MOSI_H
OUTPUT-CURRENT-SA: C101.2 IC100.17(PA3) IC100.20(PA6) ; port STM32-ADC1-4, port STM32-ADC2-3
SCLK_H: IC100.35(PB13) ; port SCLK_H
STM32-ADC12-1: C104.2 IC100.12(PA0) ; port STM32-ADC12-1
STM32-ADC12-2: C103.2 IC100.13(PA1) ; port STM32-ADC12-2
STM32-NRST: C100.1 IC100.7(PG10-NRST) R100.2 S100.2,3(COM) ; port SWD.NRESET
STM32-PWM1: IC100.11(PC3) R107.2  [project net STM32-PWM1_3]
STM32-PWM2: IC100.26(PB2) R106.2  [project net STM32-PWM2_3]
STM32-SW-AUX: IC100.62(PB9) R102.2  [project net STM32-SW-AUX_3]
STM32-SW-BOOT: IC100.61(PB8-BOOT0) R103.2  [project net STM32-SW-BOOT_3]
STM32-XC-IN: CL100.2 IC100.5(PF0-OSC_IN) Y100.1(OSC1)  [project net STM32-XC-IN_3]
STM32-XC-OUT: IC100.6(PF1-OSC_OUT) R101.2  [project net STM32-XC-OUT_3]
NetCL101_2: CL101.2 R101.1 Y100.3
NetD500_1: IC100.49(PA13) ; port SWD.SWDIO
NetD500_3: IC100.50(PA14) ; port SWD.SWDCLK
NetD500_4: IC100.56(PB3) ; port SWD.SWO
NetIC100_45: IC100.45(PA11) ; port USB-MCU.USBD_N
NetIC100_46: IC100.46(PA12) ; port USB-MCU.USBD_P
NetQ100_1: Q100.1(B) R106.1
NetQ101_1: Q101.1(B) R107.1
NetR102_1: R102.1 S101.2(COM_1)
NetR103_1: R103.1 S101.5(COM_2)

Not connected (* = marked no-connect by the designer): IC100 8(PC0) 9(PC1) 18(PA4) 19(PA5) 22(PC4) 23(PC5) 24(PB0) 25(PB1)

### Notes on the sheet
- STM32
- MCU
- Active low reset of MCU1
- (debounce cap to prevent parasitic resets)
- place close to MCU
- (near C104) place close to MCU
  C101-4: 100nF
- (near CL101) CL = 2 x (Cload - Cstray)
- Analog
- Supply
- (near C112) Analog VDD (additional filtering)
- Filtering
- Decoupling capacitors (place caps close to VDD and VSS pins of MCU1)
- Decoupling
- (near C106) Capacitors
- (near R102) BOOT Mode
- (near R103) Aux Switch
- (near R102) SW1-1 (boot mode)
- (near R103) SW1-2 (user input)
- Title
- Size:
- Date:
- A4
- Number:
- Time:
- Revision:
- Sheet
- of
- RcMPPT
- File:

### Library data of the parts
C100 C105-C112 CL100 CL101 = C0603: Capacitor; Height: 0.97
C101-C104 = C0402: Capacitor
FB100 = FB0603: Ferrite Bead; Height: 0.75mm
IC100 = STM32G474RBT6: Integrated Circuit; Manufacturer_Name: STMicroelectronics; Datasheet Link: https://www.mouser.com/datasheet/2/389/stm32g474cb-1600828.pdf; Height: 1.6mm; Manufacturer_Part_Number: STM32G474RBT6; Mouser Part Number: 511-STM32G474RBT6; Mouser Price/Stock: https://www.mouser.co.uk/ProductDetail/STMicroelectronics/STM32G474RBT6?qs=uwxL4vQweFP0uAZUZXLBhQ%3D%3D
Q100 Q101 = BC847A,235: as Q400 on sheet RcMPPT-IO; Datasheet Link: http://assets.nexperia.com/documents/data-sheet/BC847_SER.pdf; Height: 1.1mm; Manufacturer_Part_Number: BC847A,235; Mouser Part Number: 771-BC847A235; Mouser Price/Stock: https://www.mouser.co.uk/ProductDetail/Nexperia/BC847A235?qs=me8TqzrmIYWeD%252BqPzufrRA%3D%3D; Arrow Part Number: BC847A,235; Arrow Price/Stock: https://www.arrow.com/en/products/bc847a235/nexperia
R100 R102-R107 = R0603: Resistor; Height: 0.55mm
R101 = R0402: Resistor; Height: 0.4mm
S100 = SW-SPST: Switch
S101 = CAS-D20A1: Switch; Manufacturer_Name: Copal Electronics; Datasheet Link: https://www.nidec-copal-electronics.com/e/catalog/switch/cas.pdf; Height: 2.5mm; Manufacturer_Part_Number: CAS-D20A1
Y100 = ABM8W-16.0000MHZ-8-B1U-T3: Crystal or Oscillator; Manufacturer_Name: ABRACON; Datasheet Link: https://abracon.com/Resonators/ABM8W.pdf; Height: 0.75mm; Manufacturer_Part_Number: ABM8W-16.0000MHZ-8-B1U-T3; Mouser Part Number: 815-8W16-8B1UT; Mouser Price/Stock: https://www.mouser.co.uk/ProductDetail/ABRACON/ABM8W-160000MHZ-8-B1U-T3?qs=5aG0NVq1C4zuwTHNFUIcqw%3D%3D; Arrow Part Number: ABM8W-16.0000MHZ-8-B1U-T3; Arrow Price/Stock: https://www.arrow.com/en/products/abm8w-16.0000mhz-8-b1u-t3/abracon

## Sheet RcMPPT-Buck-Supply.SchDoc: RcMPPT-Buck-Supply
size A4; Author: Thomas Hofmann; CompanyName: HTL St. Pölten; Organization: Altium Limited; Address1: RcMPPT; Address2: Frenchs Forest; Address3: NSW; Address4: Australia 2086; DocumentNumber: 2; Revision: 2.0; SheetNumber: 2; SheetTotal: 8
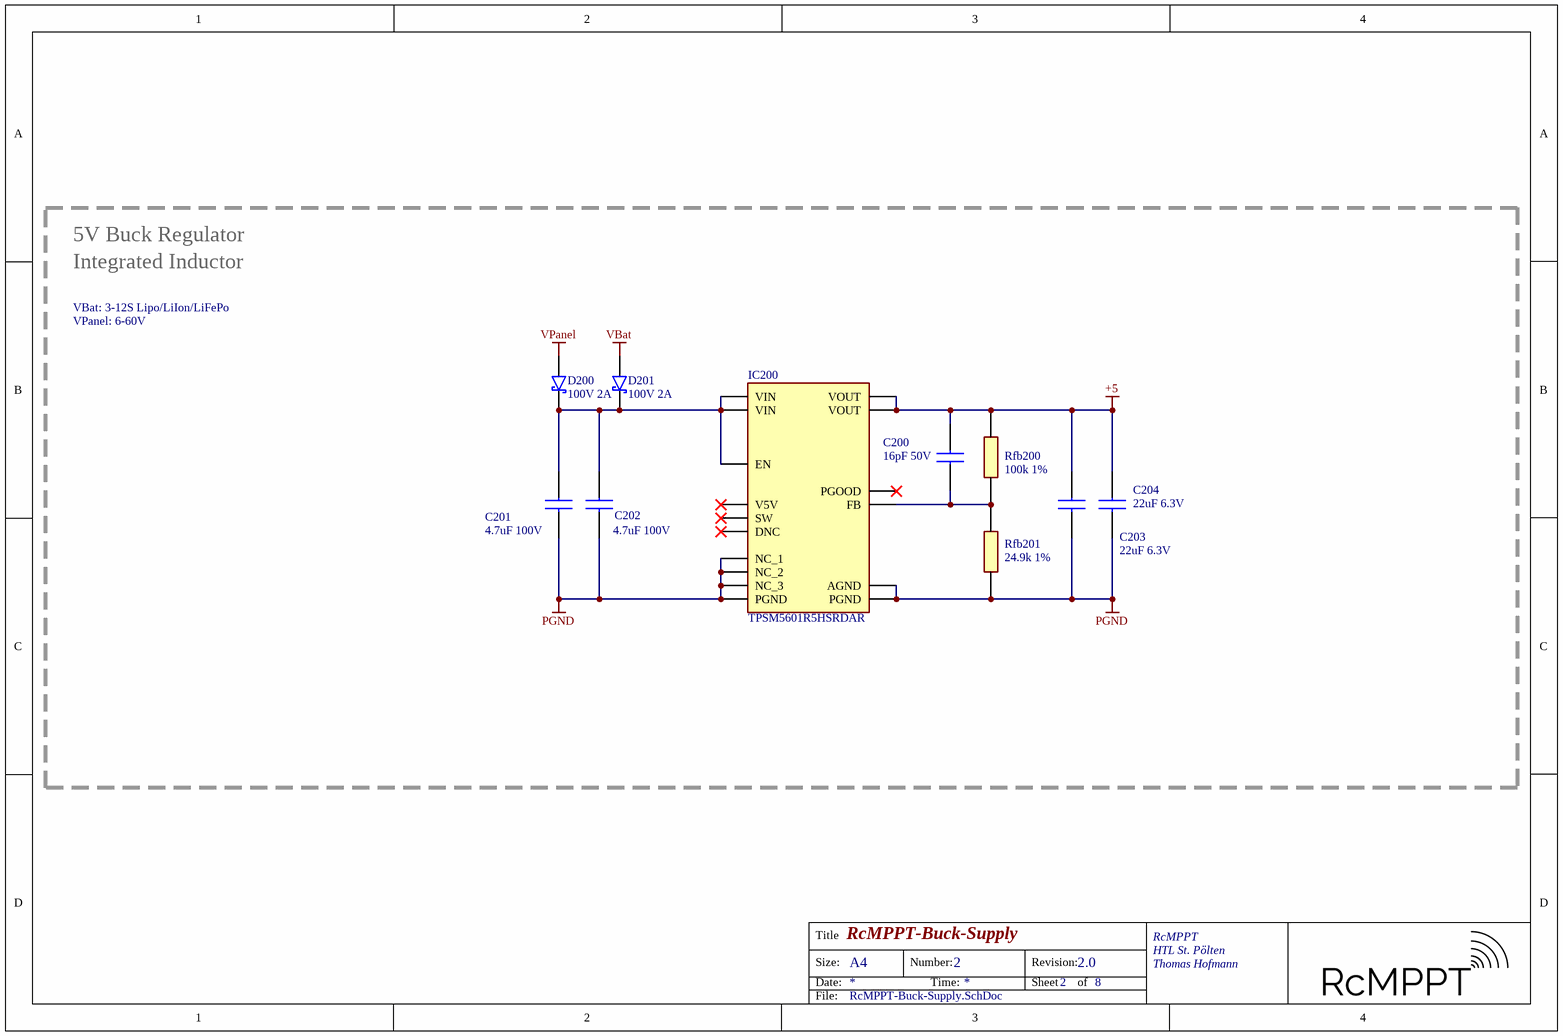
[diagram p4: RcMPPT-Buck-Supply.SchDoc]

### Parts
C200  16pF 50V  [CAPC1608X97N]
C201  4.7uF 100V  [CAPC3225X270N]
C202  4.7uF 100V  [CAPC3225X270N]
C203  22uF 6.3V  [CAPC3225X270N]
C204  22uF 6.3V  [CAPC3225X270N]
D200  100V 2A  [SOD-123FL]
D201  100V 2A  [SOD-123FL]
IC200  TPSM5601R5HSRDAR  [TPSM5601R5HSRDAR]
Rfb200  100k 1%  [RESC1608X50N]
Rfb201  24.9k 1%  [RESC1608X50N]

### Nets
+5: C200.2 C203.2 C204.2 IC200.7(VOUT) IC200.8(VOUT) Rfb200.2
PGND: C201.1 C202.1 C203.1 C204.1 IC200.3(NC_1) IC200.6(NC_2) IC200.10(AGND) IC200.13(NC_3) IC200.15,_16(PGND) IC200.17(PGND) Rfb201.1
VBat: D201.2(A)
VPanel: D200.2(A)
NetC200_1: C200.1 IC200.9(FB) Rfb200.1 Rfb201.2
NetC201_2: C201.2 C202.2 D200.1(K) D201.1(K) IC200.1(VIN) IC200.2(EN) IC200.14(VIN)

Not connected (* = marked no-connect by the designer): IC200 4(SW)* 5(DNC)* 11(V5V)* 12(PGOOD)*

### Notes on the sheet
- 5V Buck Regulator
- VBat: 3-12S Lipo/LiIon/LiFePo
- Integrated Inductor
- VPanel: 6-60V
- Title
- Size:
- Date:
- A4
- Number:
- Time:
- Revision:
- Sheet
- of
- RcMPPT
- File:

### Library data of the parts
C200 = C0603: Capacitor; Height: 0.97
C201-C204 = C1210: Capacitor; Height: 0.97mm
D200 D201 = SCHOTTKY-DIODE: Schottky Diode
IC200 = TPSM5601R5HSRDAR: Integrated Circuit; pin to pad: 15, 16>15+16; Manufacturer_Name: Texas Instruments; Datasheet Link: https://www.ti.com/lit/ds/symlink/tpsm5601r5h.pdf?ts=1622688238120&ref_url=https%253A%252F%252Fcomponentsearchengine.com%252F; Height: 4.1mm; Manufacturer_Part_Number: TPSM5601R5HSRDAR; Mouser Part Number: 595-TPSM5601R5HSRDAR; Mouser Price/Stock: https://www.mouser.co.uk/ProductDetail/Texas-Instruments/TPSM5601R5HSRDAR?qs=DRkmTr78QARQPwPAx4O%252BKQ%3D%3D; Arrow Part Number: TPSM5601R5HSRDAR; Arrow Price/Stock: https://www.arrow.com/en/products/tpsm5601r5hsrdar/texas-instruments?region=nac
Rfb200 Rfb201 = R0603: Resistor; Height: 0.55mm

## Sheet RcMPPT-Debug.SchDoc: RcMPPT-Debug
size A4; Author: Thomas Hofmann; CompanyName: HTL St. Pölten; Organization: Altium Limited; Address1: RcMPPT; Address2: Frenchs Forest; Address3: NSW; Address4: Australia 2086; DocumentNumber: 6; Revision: 2.0; SheetNumber: 6; SheetTotal: 8
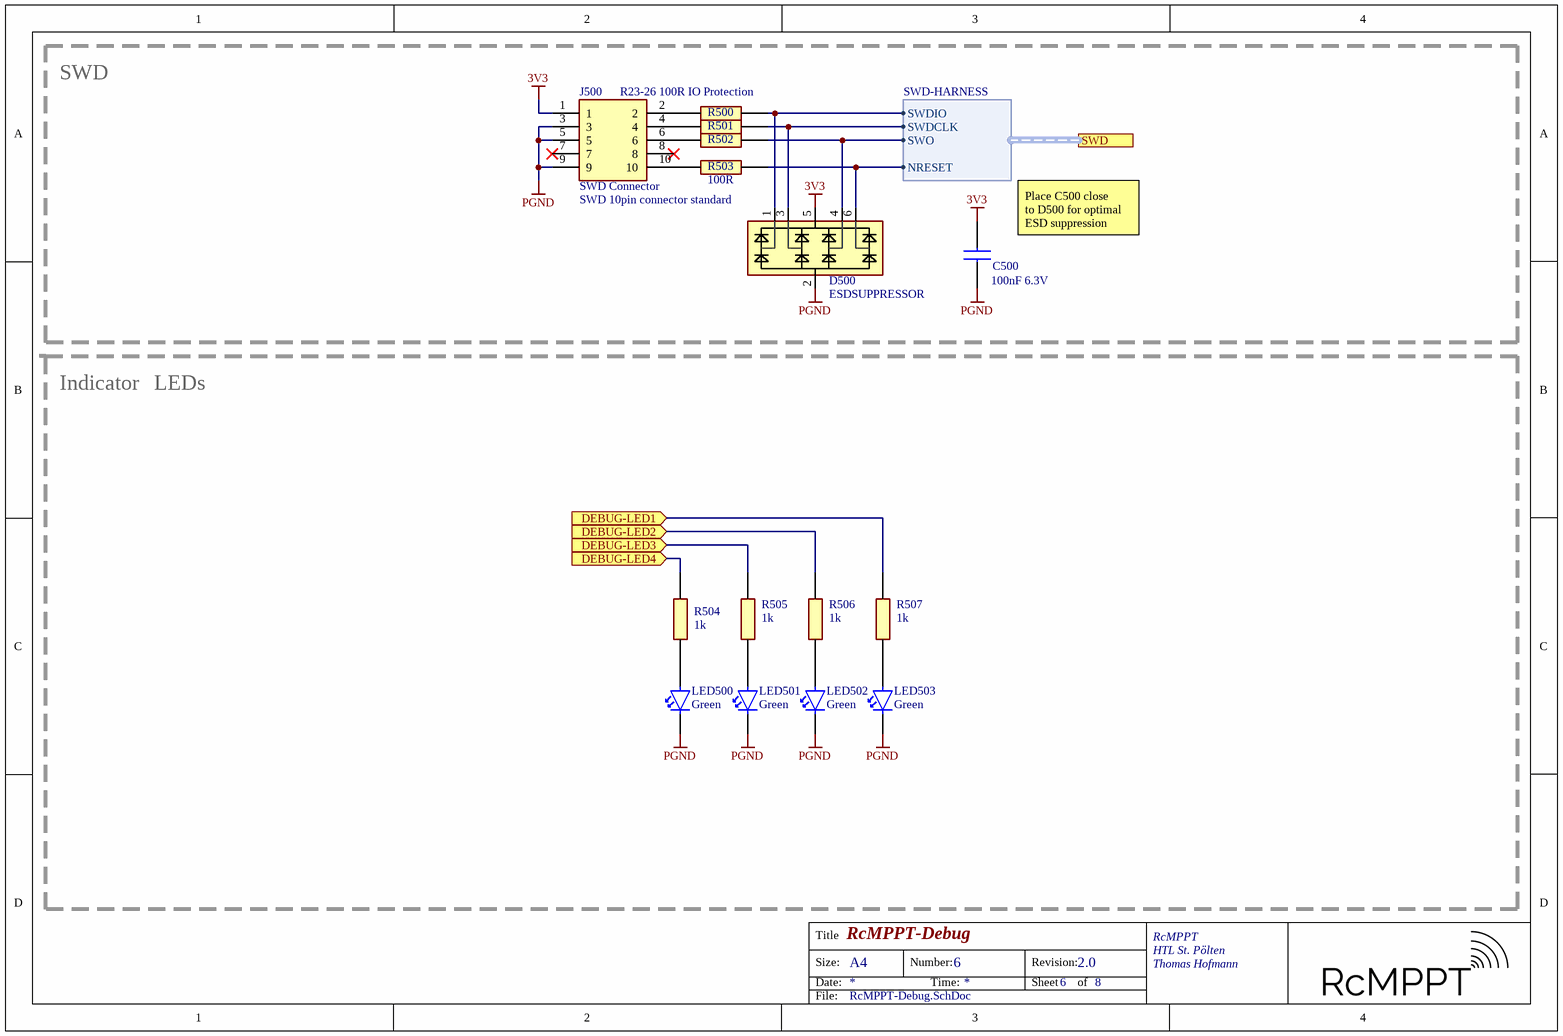
[diagram p5: RcMPPT-Debug.SchDoc]

### Parts
C500  100nF 6.3V  [CAPC1608X97N]
D500  ESDSUPPRESSOR  [SOT23-6]
J500  SWD Connector  [HUSSP10W40P127_2X5_635X340X420P]
LED500  Green  [CHIPLED_0603]
LED501  Green  [CHIPLED_0603]
LED502  Green  [CHIPLED_0603]
LED503  Green  [CHIPLED_0603]
R500  100R  [RESC1005X40N]  (value not drawn)
R501  100R  [RESC1005X40N]  (value not drawn)
R502  100R  [RESC1005X40N]  (value not drawn)
R503  100R  [RESC1005X40N]
R504  1k  [RESC1608X50N]
R505  1k  [RESC1608X50N]
R506  1k  [RESC1608X50N]
R507  1k  [RESC1608X50N]

### Blocks framed on the sheet
SWD: C500 D500 J500 R500-R503

### Ports
DEBUG-LED1 (in), DEBUG-LED2 (in), DEBUG-LED3 (in), DEBUG-LED4 (in), SWD (harness SWD-HARNESS)

### Harnesses
SWD-HARNESS: SWDIO, SWDCLK, SWO, NRESET

### Nets
3V3: C500.2 D500.5(VDD) J500.1
PGND: C500.1 D500.2(GND) J500.3 J500.5 J500.9 LED500.1(K) LED501.1(K) LED502.1(K) LED503.1(K)
DEBUG-LED1: R507.1 ; port DEBUG-LED1
DEBUG-LED2: R506.1 ; port DEBUG-LED2
DEBUG-LED3: R505.1 ; port DEBUG-LED3
DEBUG-LED4: R504.1 ; port DEBUG-LED4
STM32-NRST: D500.6(CH4) R503.2 ; port SWD.NRESET
NetD500_1: D500.1(CH1) R500.2 ; port SWD.SWDIO
NetD500_3: D500.3(CH2) R501.2 ; port SWD.SWDCLK
NetD500_4: D500.4(CH3) R502.2 ; port SWD.SWO
NetJ500_2: J500.2 R500.1
NetJ500_4: J500.4 R501.1
NetJ500_6: J500.6 R502.1
NetJ500_10: J500.10 R503.1
NetLED500_2: LED500.2(A) R504.2
NetLED501_2: LED501.2(A) R505.2
NetLED502_2: LED502.2(A) R506.2
NetLED503_2: LED503.2(A) R507.2

Not connected (* = marked no-connect by the designer): J500 7* 8*

### Notes on the sheet
- R23-26 100R IO Protection
- SWD 10pin connector standard
- (near C500) Place C500 close
  to D500 for optimal
  ESD suppression
- Indicator
- LEDs
- Title
- Size:
- Date:
- A4
- Number:
- Time:
- Revision:
- Sheet
- of
- RcMPPT
- File:

### Library data of the parts
C500 = C0603: Capacitor; Height: 0.97
D500 = ESDSUPPRESSOR: TVS Diode Array; Height: 0.6mm
J500 = M50-3600542R: Connector; Manufacturer_Name: Harwin; Datasheet Link: https://cdn.harwin.com/pdfs/M50-360R.pdf; Manufacturer_Part_Number: M50-3600542R; Mouser Part Number: 855-M50-3600542R; Mouser Price/Stock: https://www.mouser.co.uk/ProductDetail/Harwin/M50-3600542R?qs=DVxm2sPGGrrPu%2FxuhpV3yw%3D%3D
LED500-LED503 = CHIPLED0603: LED; Mouser Price/Stock: https://www.mouser.at/c/optoelectronics/led-lighting/led-emitters/standard-leds-smd/?series=CHIPLED%200603&instock=y
R500-R503 = R0402: Resistor; Height: 0.4mm
R504-R507 = R0603: Resistor; Height: 0.55mm

## Sheet RcMPPT-Supply.SchDoc: RcMPPT-Supply
size A4; Author: Thomas Hofmann; CompanyName: HTL St. Pölten; Organization: Altium Limited; Address1: RcMPPT; Address2: Frenchs Forest; Address3: NSW; Address4: Australia 2086; DocumentNumber: 7; Revision: 2.0; SheetNumber: 7; SheetTotal: 8
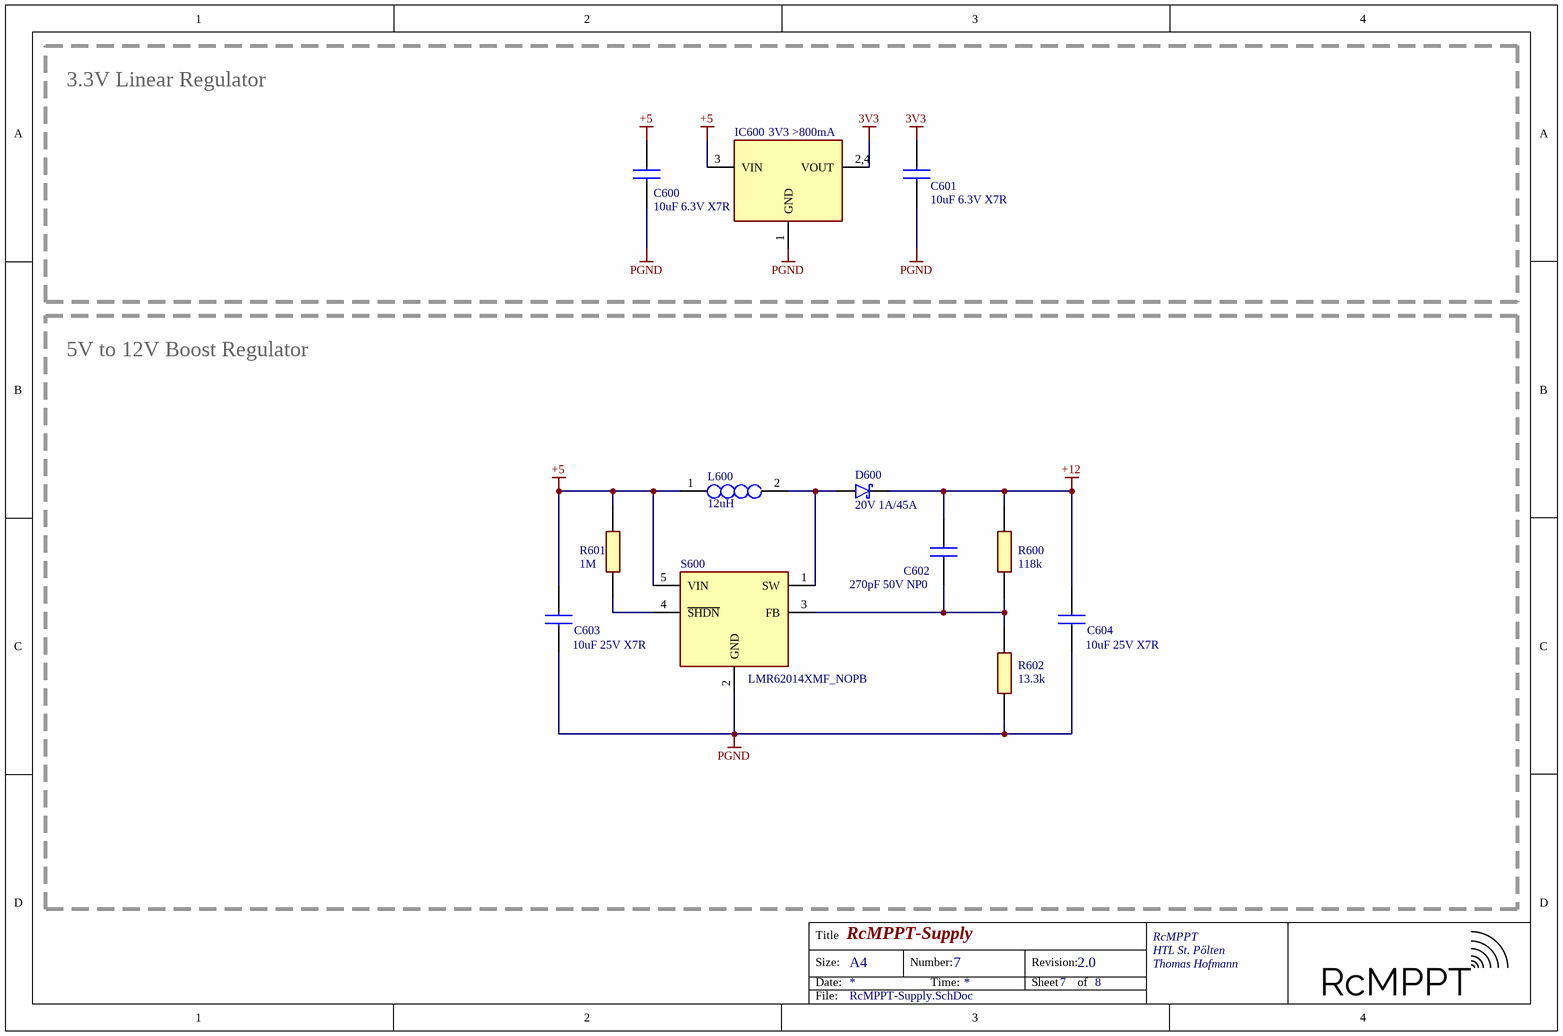
[diagram p6: RcMPPT-Supply.SchDoc]

### Parts
C600  10uF 6.3V X7R  [CAPC3216X180N]
C601  10uF 6.3V X7R  [CAPC3216X180N]
C602  270pF 50V NP0  [CAPC1608X97N]
C603  10uF 25V X7R  [CAPC3225X270N]
C604  10uF 25V X7R  [CAPC3225X270N]
D600  20V 1A/45A  [SOD-123FL]
IC600  3V3 >800mA  [SOT230P700X180-4N]
L600  12uH  [INDPM4141X310N]
R600  118k  [RESC1608X50N]
R601  1M  [RESC1608X50N]
R602  13.3k  [RESC1608X50N]
S600  LMR62014XMF_NOPB  [SOT95P280X145-5N]

### Blocks framed on the sheet
3.3V Linear Regulator: C600 C601 IC600
5V to 12V Boost Regulator: C602-C604 D600 L600 R600-R602 S600

### Nets
3V3: C601.2 IC600.2,4(VOUT)
+5: C600.2 C603.1 IC600.3(VIN) L600.1 R601.2 S600.5(VIN)
+12: C602.1 C604.1 D600.1(K) R600.1
PGND: C600.1 C601.1 C603.2 C604.2 IC600.1(GND) R602.2 S600.2(GND)
NetC602_2: C602.2 R600.2 R602.1 S600.3(FB)
NetD600_2: D600.2(A) L600.2 S600.1(SW)
NetR601_1: R601.1 S600.4(~{SHDN})

### Notes on the sheet
- Title
- Size:
- Date:
- A4
- Number:
- Time:
- Revision:
- Sheet
- of
- RcMPPT
- File:

### Library data of the parts
C600 C601 = C1206: Capacitor; Height: 1.8mm
C602 = C0603: Capacitor; Height: 0.97
C603 C604 = C1210: Capacitor; Height: 0.97mm
D600 = SCHOTTKY-DIODE: Schottky Diode
IC600 = LDO-SOT223: LDO
L600 = 78438357100: Inductor; Manufacturer_Name: Wurth Elektronik; Datasheet Link: https://katalog.we-online.de/pbs/datasheet/78438357100.pdf; Height: 3.1mm; Manufacturer_Part_Number: 78438357100; Mouser Part Number: 710-78438357100; Mouser Price/Stock: https://www.mouser.co.uk/ProductDetail/Wurth-Elektronik/78438357100?qs=f9yNj16SXrI9saR5LXmRyQ%3D%3D
R600-R602 = R0603: Resistor; Height: 0.55mm
S600 = LMR62014XMF_NOPB: Switch; Manufacturer_Name: Texas Instruments; Manufacturer_Part_Number: LMR62014XMF/NOPB; Datasheet Link: http://www.ti.com/lit/gpn/lmr62014; Height: 1.45mm; Mouser Part Number: 926-LMR62014XMF/NOPB; Mouser Price/Stock: https://www.mouser.co.uk/ProductDetail/Texas-Instruments/LMR62014XMF-NOPB?qs=cN01o9PeIQtA177Vn0GXdQ%3D%3D; Arrow Part Number: LMR62014XMF/NOPB; Arrow Price/Stock: https://www.arrow.com/en/products/lmr62014xmfnopb/texas-instruments

## Sheet RcMPPT-BMS-Interface.SchDoc: RcMPPT-BMS-Interface
size A4; Author: Thomas Hofmann; CompanyName: HTL St. Pölten; Organization: Altium Limited; Address1: RcMPPT; Address2: Frenchs Forest; Address3: NSW; Address4: Australia 2086; DocumentNumber: 8; Revision: 2.0; SheetNumber: 8; SheetTotal: 8
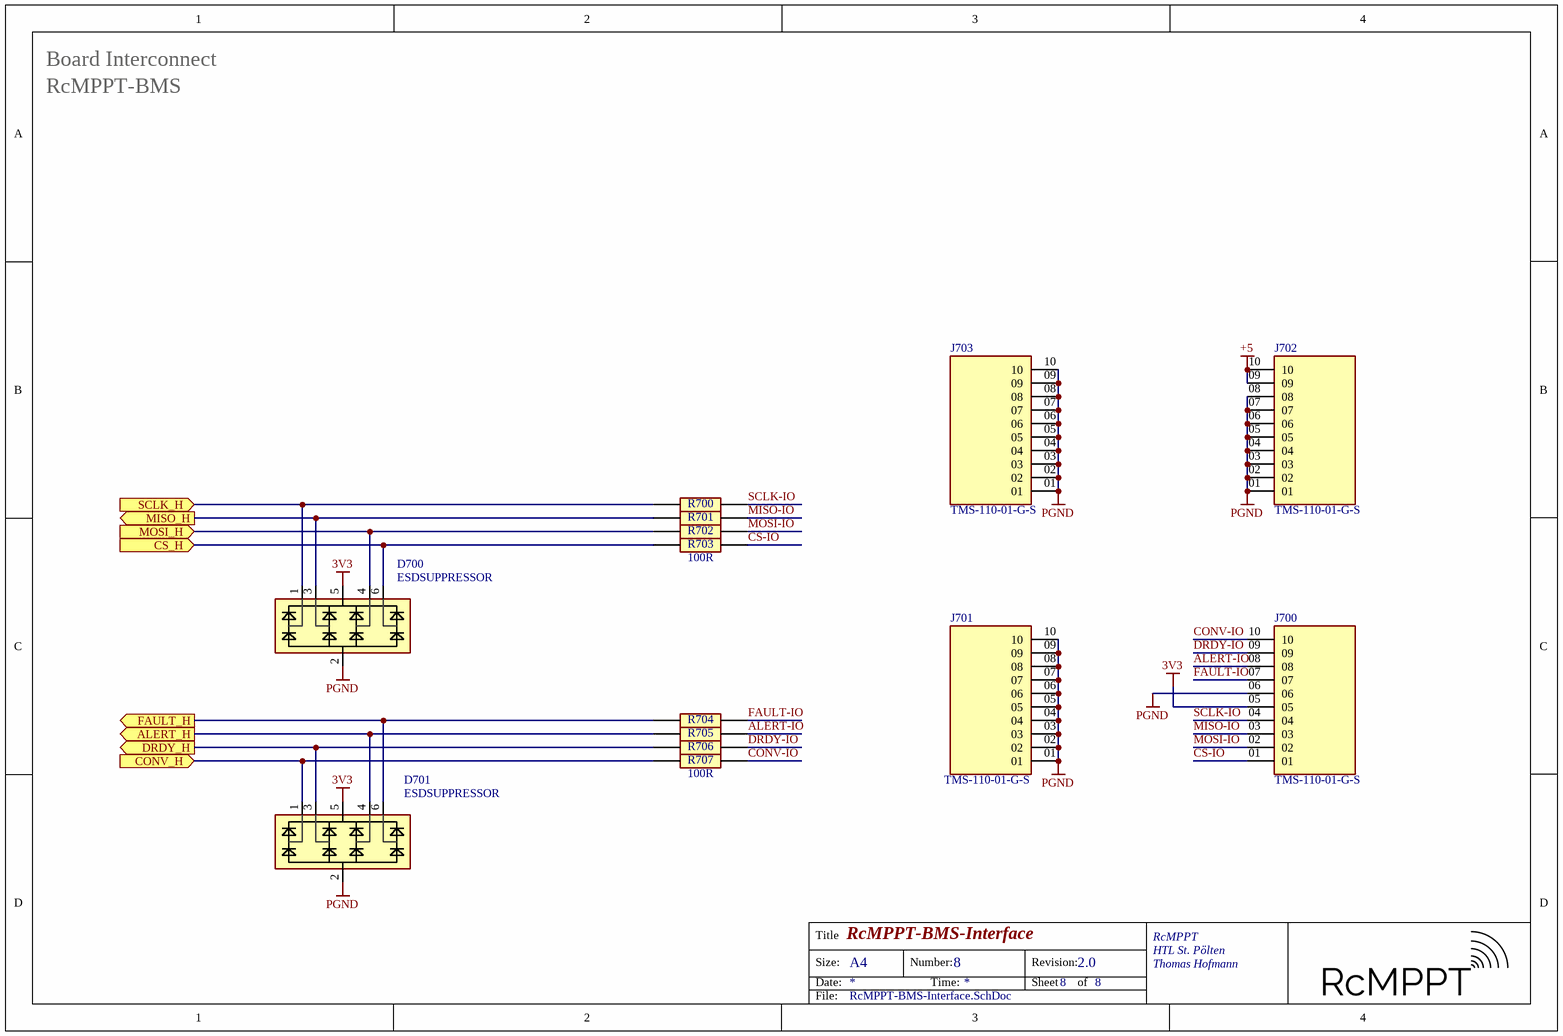
[diagram p7: RcMPPT-BMS-Interface.SchDoc]

### Parts
D700  ESDSUPPRESSOR  [SOT23-6]
D701  ESDSUPPRESSOR  [SOT23-6]
J700  TMS-110-01-G-S  [SAMTEC_TMS-110-01-G-S]
J701  TMS-110-01-G-S  [SAMTEC_TMS-110-01-G-S]
J702  TMS-110-01-G-S  [SAMTEC_TMS-110-01-G-S]
J703  TMS-110-01-G-S  [SAMTEC_TMS-110-01-G-S]
R700  100R  [RESC1005X40N]  (value not drawn)
R701  100R  [RESC1005X40N]  (value not drawn)
R702  100R  [RESC1005X40N]  (value not drawn)
R703  100R  [RESC1005X40N]
R704  100R  [RESC1005X40N]  (value not drawn)
R705  100R  [RESC1005X40N]  (value not drawn)
R706  100R  [RESC1005X40N]  (value not drawn)
R707  100R  [RESC1005X40N]

### Ports
ALERT_H (out), CONV_H (in), CS_H (in), DRDY_H (out), FAULT_H (out), MISO_H (out), MOSI_H (in), SCLK_H (in)

### Nets
3V3: D700.5(VDD) D701.5(VDD) J700.05
+5: J702.09 J702.10
PGND: D700.2(GND) D701.2(GND) J700.06 J701.01 J701.02 J701.03 J701.04 J701.05 J701.06 J701.07 J701.08 J701.09 J701.10 J702.01 J702.02 J702.03 J702.04 J702.05 J702.06 J702.07 J702.08 J703.01 J703.02 J703.03 J703.04 J703.05 J703.06 J703.07 J703.08 J703.09 J703.10
ALERT-IO: J700.08 R705.2  [project net ALERT-IO_8]
ALERT_H: D701.4(CH3) R705.1 ; port ALERT_H
CONV-IO: J700.10 R707.2  [project net CONV-IO_8]
CONV_H: D701.1(CH1) R707.1 ; port CONV_H
CS-IO: J700.01 R703.2  [project net CS-IO_8]
CS_H: D700.6(CH4) R703.1 ; port CS_H
DRDY-IO: J700.09 R706.2  [project net DRDY-IO_8]
DRDY_H: D701.3(CH2) R706.1 ; port DRDY_H
FAULT-IO: J700.07 R704.2  [project net FAULT-IO_8]
FAULT_H: D701.6(CH4) R704.1 ; port FAULT_H
MISO-IO: J700.03 R701.2  [project net MISO-IO_8]
MISO_H: D700.3(CH2) R701.1 ; port MISO_H
MOSI-IO: J700.02 R702.2  [project net MOSI-IO_8]
MOSI_H: D700.4(CH3) R702.1 ; port MOSI_H
SCLK-IO: J700.04 R700.2  [project net SCLK-IO_8]
SCLK_H: D700.1(CH1) R700.1 ; port SCLK_H

### Notes on the sheet
- Board Interconnect
- RcMPPT-BMS
- Title
- Size:
- Date:
- A4
- Number:
- Time:
- Revision:
- Sheet
- of
- RcMPPT
- File:

### Library data of the parts
D700 D701 = ESDSUPPRESSOR: TVS Diode Array; Height: 0.6mm
J700-J703 = TMS-110-01-G-S: MF: {'manufacturer': u'Samtec'}; Package: None; Availability: Unavailable; Value: *; MP: TMS-110-01-G-S; Price: None
R700-R707 = R0402: Resistor; Height: 0.4mm

## Nets that join several sheets
3V3: RcMPPT-IO (11 pins), RcMPPT-MCU (16 pins), RcMPPT-Debug (C500.2 D500.5 J500.1), RcMPPT-Supply (C601.2 IC600.2,4), RcMPPT-BMS-Interface (D700.5 D701.5 J700.05)
+5: RcMPPT-IO (D400.1 D403.5 J404.4 R409.2), RcMPPT-Buck-Supply (6 pins), RcMPPT-Supply (6 pins), RcMPPT-BMS-Interface (J702.09 J702.10)
+12: RcMPPT-DCDC (8 pins), RcMPPT-MCU (R104.2 R105.2), RcMPPT-Supply (C602.1 C604.1 D600.1 R600.1)
A3V3: RcMPPT-DCDC (8 pins), RcMPPT-MCU (C105.1 FB100.2 IC100.28 IC100.29)
PGND: RcMPPT-DCDC (30 pins), RcMPPT-IO (15 pins), RcMPPT-MCU (27 pins), RcMPPT-Buck-Supply (11 pins), RcMPPT-Debug (9 pins), RcMPPT-Supply (7 pins), RcMPPT-BMS-Interface (31 pins)
VBat: RcMPPT-DCDC (P300.1 R300.3 R306.2), RcMPPT-Buck-Supply (D201.2)
VPanel: RcMPPT-DCDC (P301.1 R301.2 R307.2), RcMPPT-Buck-Supply (D200.2)
ALERT_H: RcMPPT-MCU (IC100.57), RcMPPT-BMS-Interface (D701.4 R705.1)
BOOST-BIN: RcMPPT-DCDC (IC303.2), RcMPPT-MCU (IC100.43)
BOOST-TIN: RcMPPT-DCDC (IC303.1), RcMPPT-MCU (IC100.42)
BOOT-CHGPMP-VBAT: RcMPPT-DCDC (Q306.1), RcMPPT-MCU (Q100.3 R104.1)
BOOT-CHGPMP-VIN: RcMPPT-DCDC (Q307.1), RcMPPT-MCU (Q101.3 R105.1)
BUCK-BIN: RcMPPT-DCDC (IC302.2), RcMPPT-MCU (IC100.41)
BUCK-TIN: RcMPPT-DCDC (IC302.1), RcMPPT-MCU (IC100.40)
CONV_H: RcMPPT-MCU (IC100.44), RcMPPT-BMS-Interface (D701.1 R707.1)
CS_H: RcMPPT-MCU (IC100.34), RcMPPT-BMS-Interface (D700.6 R703.1)
DEBUG-LED1: RcMPPT-MCU (IC100.10), RcMPPT-Debug (R507.1)
DEBUG-LED2: RcMPPT-MCU (IC100.4), RcMPPT-Debug (R506.1)
DEBUG-LED3: RcMPPT-MCU (IC100.3), RcMPPT-Debug (R505.1)
DEBUG-LED4: RcMPPT-MCU (IC100.2), RcMPPT-Debug (R504.1)
DRDY_H: RcMPPT-MCU (IC100.58), RcMPPT-BMS-Interface (D701.3 R706.1)
FAULT_H: RcMPPT-MCU (IC100.55), RcMPPT-BMS-Interface (D701.6 R704.1)
INPUT-CURRENT-SA: RcMPPT-DCDC (IC301.8), RcMPPT-MCU (C102.2 IC100.14 IC100.21)
IO-I2C-SCL: RcMPPT-IO (D404.6 R401.1 R404.2), RcMPPT-MCU (IC100.38)
IO-I2C-SDA: RcMPPT-IO (D404.1 R402.1 R403.2), RcMPPT-MCU (IC100.39)
IO-SBUS-RX: RcMPPT-IO (Q401.3 R400.1), RcMPPT-MCU (IC100.60)
IO-SBUS-TX: RcMPPT-IO (R411.2), RcMPPT-MCU (IC100.59)
IO-SPI-MISO: RcMPPT-IO (D401.1 R406.1), RcMPPT-MCU (IC100.53)
IO-SPI-MOSI: RcMPPT-IO (D401.3 R405.1), RcMPPT-MCU (IC100.54)
IO-SPI-NCS: RcMPPT-IO (D401.4 R408.1), RcMPPT-MCU (IC100.51)
IO-SPI-SCL: RcMPPT-IO (D401.6 R407.1), RcMPPT-MCU (IC100.52)
IO-UART-RX: RcMPPT-IO (D402.6 R413.1), RcMPPT-MCU (IC100.33)
IO-UART-TX: RcMPPT-IO (D402.1 R412.1), RcMPPT-MCU (IC100.30)
MISO_H: RcMPPT-MCU (IC100.36), RcMPPT-BMS-Interface (D700.3 R701.1)
MOSI_H: RcMPPT-MCU (IC100.37), RcMPPT-BMS-Interface (D700.4 R702.1)
NetD500_1: RcMPPT-MCU (IC100.49), RcMPPT-Debug (D500.1 R500.2)
NetD500_3: RcMPPT-MCU (IC100.50), RcMPPT-Debug (D500.3 R501.2)
NetD500_4: RcMPPT-MCU (IC100.56), RcMPPT-Debug (D500.4 R502.2)
NetIC100_45: RcMPPT-IO (IC400.6), RcMPPT-MCU (IC100.45)
NetIC100_46: RcMPPT-IO (IC400.4), RcMPPT-MCU (IC100.46)
OUTPUT-CURRENT-SA: RcMPPT-DCDC (IC300.8), RcMPPT-MCU (C101.2 IC100.17 IC100.20)
SCLK_H: RcMPPT-MCU (IC100.35), RcMPPT-BMS-Interface (D700.1 R700.1)
STM32-ADC12-1: RcMPPT-DCDC (D301.3 R307.1 R309.2), RcMPPT-MCU (C104.2 IC100.12)
STM32-ADC12-2: RcMPPT-DCDC (D300.3 R306.1 R308.2), RcMPPT-MCU (C103.2 IC100.13)
STM32-NRST: RcMPPT-MCU (C100.1 IC100.7 R100.2 S100.2,3), RcMPPT-Debug (D500.6 R503.2)